# EAGLE board OpenPneu_ver2 (EAGLE 9.6.2), part 1 of 2
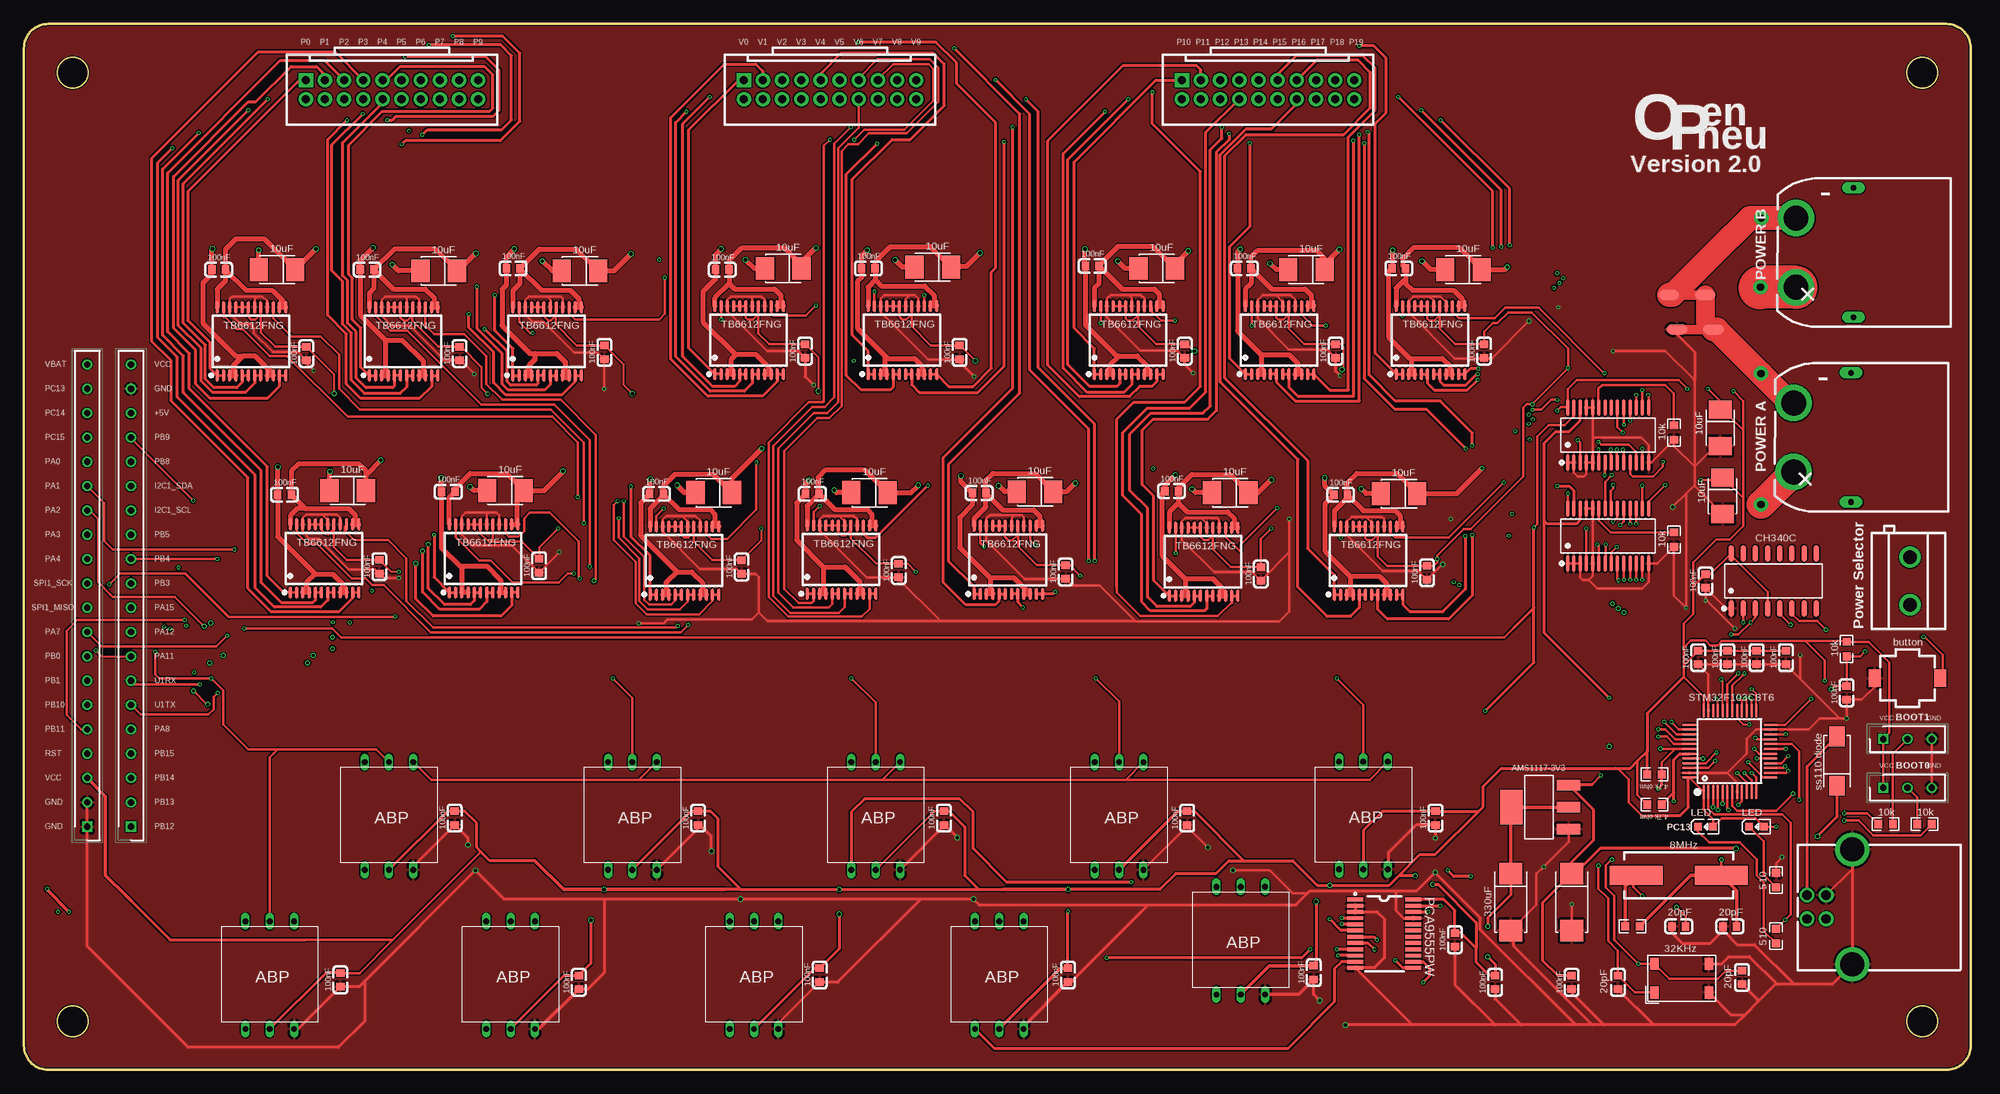
[diagram p3: board, top side]
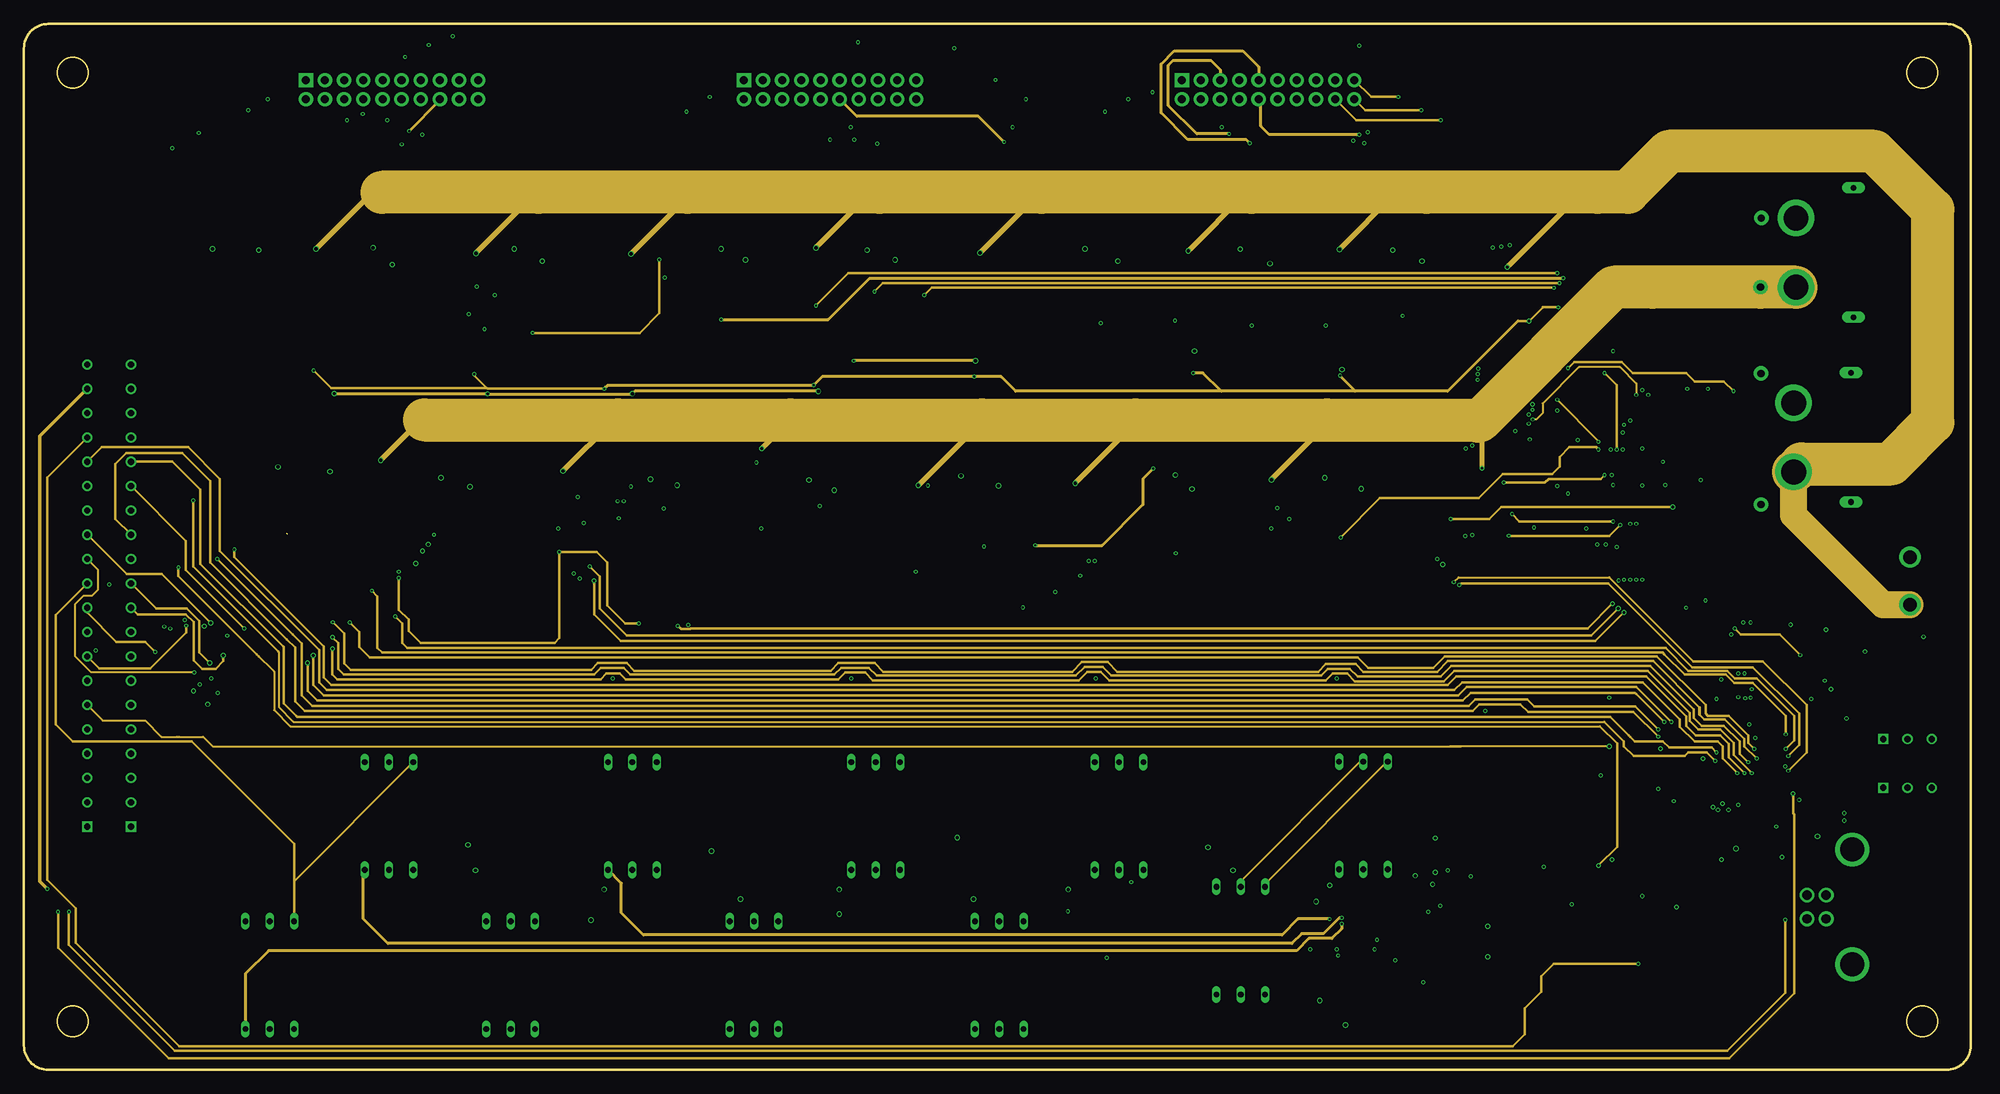
[diagram p4: board, inner layer Route2]
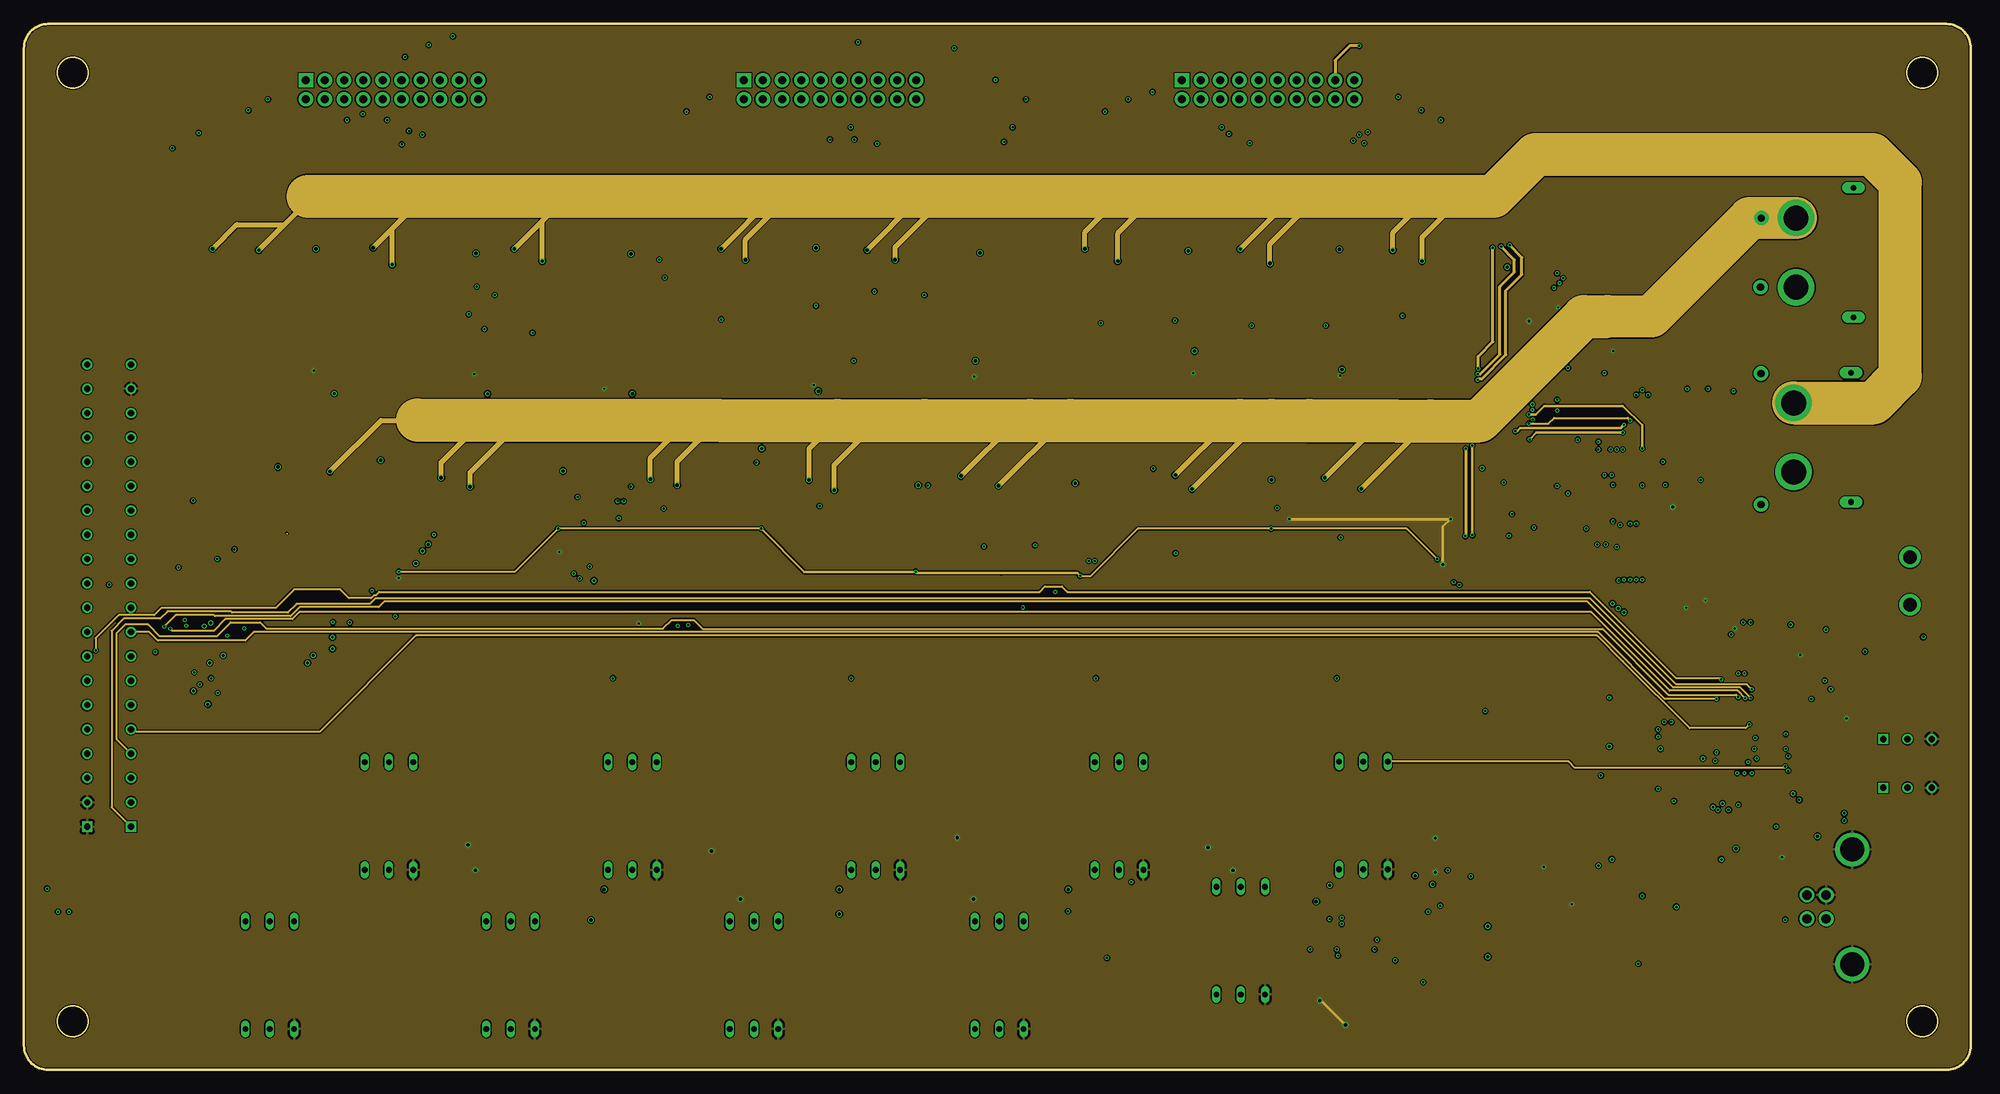
[diagram p5: board, inner layer Route15]
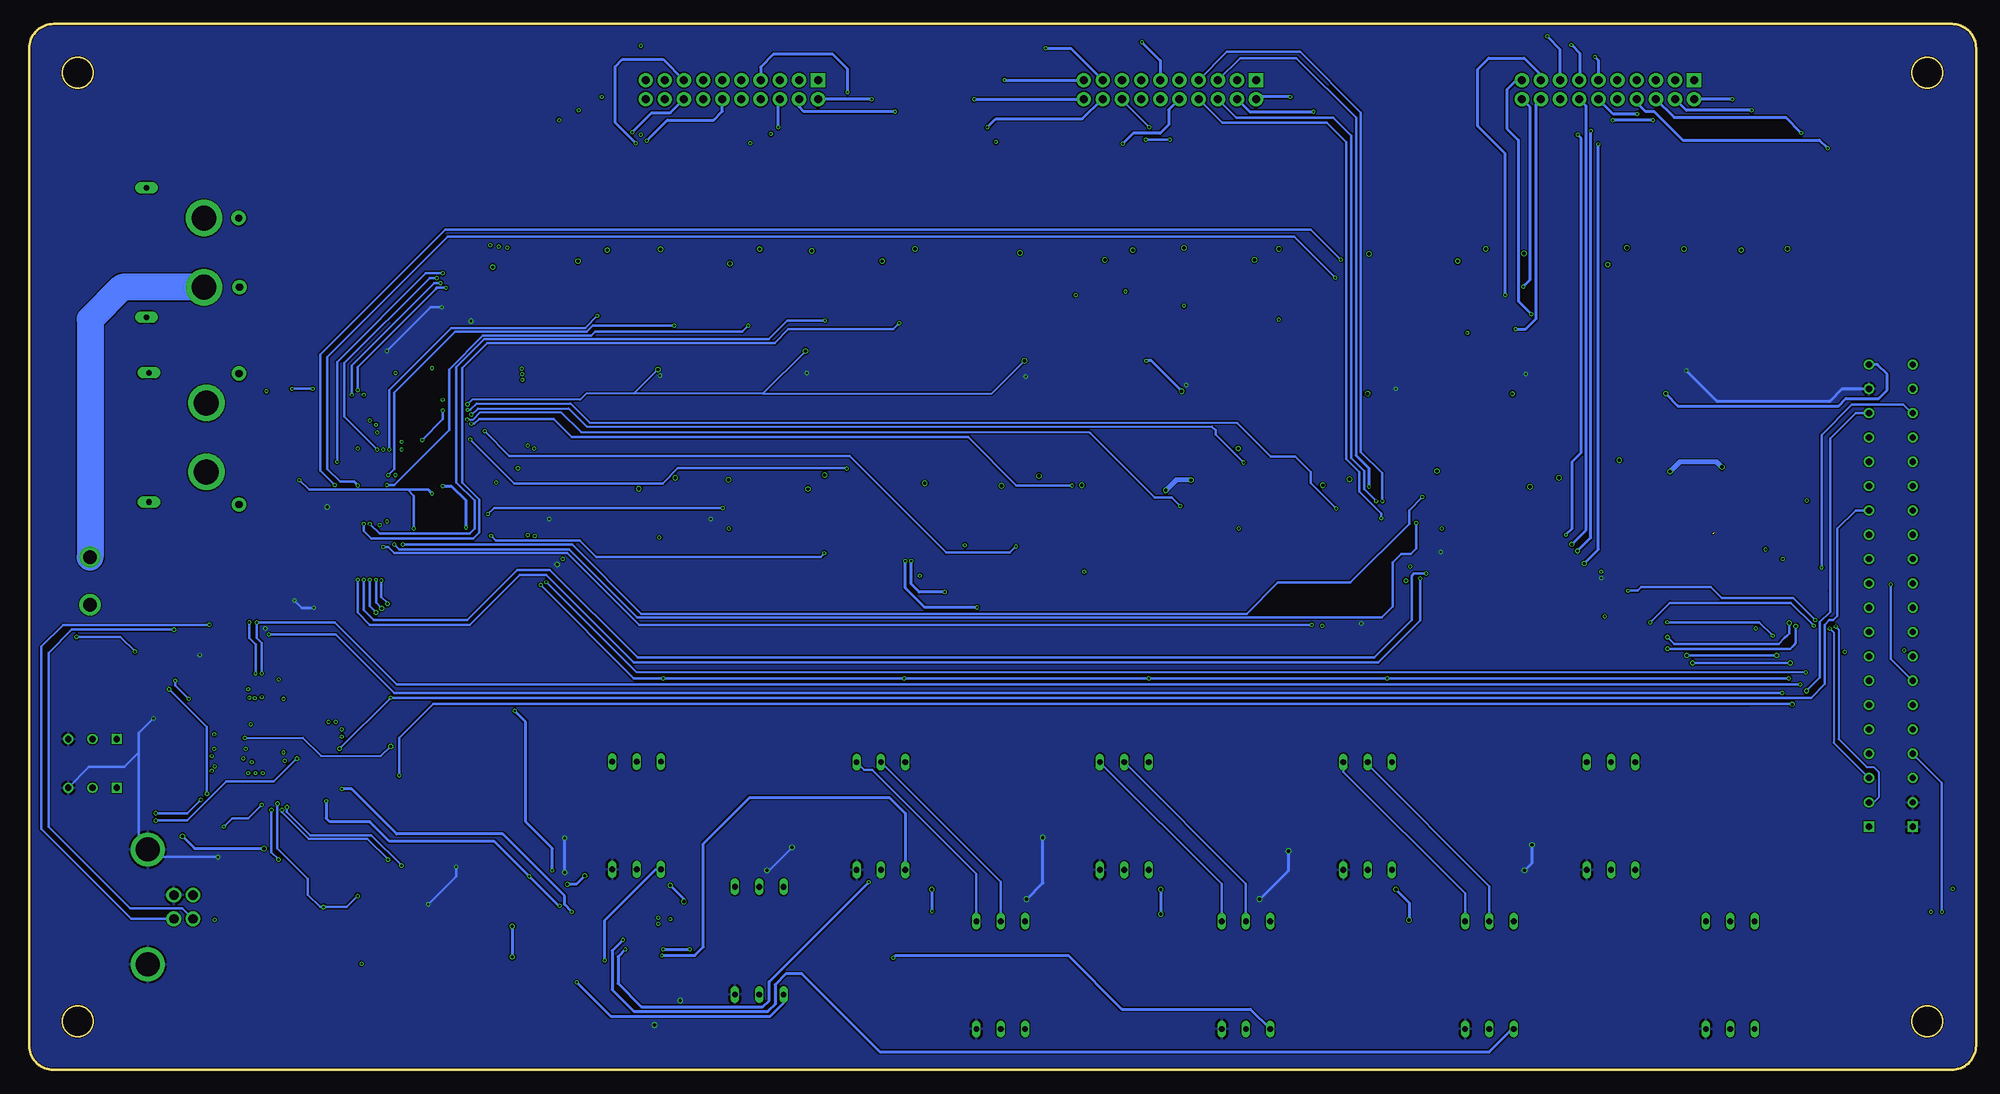
[diagram p6: board, bottom side, seen from below]

Size 203.2 x 109.22 mm. Coordinates in mm from the lower left corner, seen from the top.
Outline: 27.4,56.08 27.5,55.98
Outline: 0,106.68 0,2.54 arc90 2.54,0 200.66,0 arc90 203.2,2.54 203.2,106.68 arc90 200.66,109.22 2.54,109.22 arc90 0,106.68
Outline: circle at 198.12,104.14 radius 1.6
Outline: circle at 5.08,104.14 radius 1.6
Outline: circle at 5.08,5.08 radius 1.6
Outline: circle at 198.12,5.08 radius 1.6
Copper layers (1*2*15*16): Top 0.035559375mm / dielectric 0.17018125mm / Route2 0.01778125mm / dielectric 47mil / Route15 0.01778125mm / dielectric 0.17018125mm / Bottom 0.035559375mm
Design rules "jlcpcb-4-layer": minimum track width 5mil, minimum drill 0.2mm, track to track 0.126490625mm, track to pad 0.126490625mm, pad to pad 0.126490625mm, via to via 0.126490625mm, smd to smd 0mil, copper to edge 0.1mm, drill to drill 5mil, minimum pad ring 4mil, minimum via ring 4mil, stop-mask expansion 3mil, vias tented up to drill 100mil, thermal gap 10mil

## Footprints (pad centres in the part's own frame; a part is rotated, then mirrored left to right if it is on the bottom)
HDRV20W46P0X254_1X20_5090X254X = drill 0.65 pad 1.05 square: 1 0,0 | drill 0.65 pad 1.05: 2 2.54,0; 3 5.08,0; 4 7.62,0; 5 10.16,0; 6 12.7,0; 7 15.24,0; 8 17.78,0; 9 20.32,0; 10 22.86,0; 11 25.4,0; 12 27.94,0; 13 30.48,0; 14 33.02,0; 15 35.56,0; 16 38.1,0; 17 40.64,0; 18 43.18,0; 19 45.72,0; 20 48.26,0
LQFP-48_L7.0-W7.0-P0.50-LS9.27PRIMARY = smd 0.279 x 1.499: 1 -2.743,-4.242; 2 -2.261,-4.242; 3 -1.753,-4.242; 4 -1.245,-4.242; 5 -0.762,-4.242; 6 -0.254,-4.242; 7 0.254,-4.242; 8 0.762,-4.242; 9 1.245,-4.242; 10 1.753,-4.242; 11 2.261,-4.242; 12 2.743,-4.242; 25 2.743,4.242; 26 2.261,4.242; 27 1.753,4.242; 28 1.245,4.242; 29 0.762,4.242; 30 0.254,4.242; 31 -0.254,4.242; 32 -0.762,4.242; 33 -1.245,4.242; 34 -1.753,4.242; 35 -2.261,4.242; 36 -2.743,4.242 | smd 1.499 x 0.279: 13 4.242,-2.743; 14 4.242,-2.261; 15 4.242,-1.753; 16 4.242,-1.245; 17 4.242,-0.762; 18 4.242,-0.254; 19 4.242,0.254; 20 4.242,0.762; 21 4.242,1.245; 22 4.242,1.753; 23 4.242,2.261; 24 4.242,2.743; 37 -4.242,2.743; 38 -4.242,2.261; 39 -4.242,1.753; 40 -4.242,1.245; 41 -4.242,0.762; 42 -4.242,0.254; 43 -4.242,-0.254; 44 -4.242,-0.762; 45 -4.242,-1.245; 46 -4.242,-1.753; 47 -4.242,-2.261; 48 -4.242,-2.743
CRYSTAL-SMD_L11.5-W4.8-LS12.A9PRIMARY = smd 5.512 x 2.007: 1 -4.445,0; 2 4.445,0
C0603_1PRIMARY = smd 0.787 x 0.889: 1 -0.711,0; 2 0.711,0
R0603_1PRIMARY = smd 0.813 x 0.864: 1 -0.762,0; 2 0.762,0
MC-306_4P-L8.0-W3.2-P5.5-BL_1PRIMARY = smd 0.889 x 1.295: 1 -2.54,-1.575; 2 3.15,-1.575; 3 3.15,1.422; 4 -2.54,1.422
SOT-223-3_L6.5-W3.4-P2.30-LS59PRIMARY = smd 2.489 x 1.092: 1 2.972,-2.311; 2 2.972,0; 3 2.972,2.311 | smd 2.337 x 3.607: 4 -2.972,0
CAP-SMD_L6.0-W3.2-R-RD_1PRIMARY = smd 2.21 x 2.388: 1 2.972,0; 2 -2.972,0
USB-B-TH_USB-B01_1PRIMARY = drill 0.991 pad 1.524: 1 -1.245,-2.362; 2 1.245,-2.362; 3 1.245,-0.356; 4 -1.245,-0.356 | drill 2.489 pad 3.302: 5 -5.994,2.362; 6 5.994,2.362
SMA_L4.4-W2.8-LS5.4-RD_1PRIMARY = smd 2.057 x 1.626: 1 -2.565,0; 2 2.565,0
SOP-16_L10.0-W3.9-P1.27-LS6.C7PRIMARY = smd 0.559 x 1.753: 1 -4.445,-2.87; 2 -3.175,-2.87; 3 -1.905,-2.87; 4 -0.635,-2.87; 5 0.635,-2.87; 6 1.905,-2.87; 7 3.175,-2.87; 8 4.445,-2.87; 9 4.445,2.87; 10 3.175,2.87; 11 1.905,2.87; 12 0.635,2.87; 13 -0.635,2.87; 14 -1.905,2.87; 15 -3.175,2.87; 16 -4.445,2.87
HDRV20W46P0X254_1X20_5090X254X' = drill 0.65 pad 1.05 square: 1 0,0 | drill 0.65 pad 1.05: 2 2.54,0; 3 5.08,0
SW-SMD_SMK_JPM1040-XXXXFC_1PRIMARY = smd 1.245 x 1.803: 1 -3.429,0; 2 3.429,0
CONN-TH_P5.00_KF301-5.0-2P_1PRIMARY = drill 1.397 pad 2.21: 1 -2.489,0; 2 2.489,0
TSSOP-28_L9.7-W4.4-P0.65-LS6FFPRIMARY = smd 0.356 x 1.727: 1 -4.216,-2.87; 2 -3.581,-2.87; 3 -2.921,-2.87; 4 -2.286,-2.87; 5 -1.626,-2.87; 6 -0.965,-2.87; 7 -0.33,-2.87; 8 0.33,-2.87; 9 0.965,-2.87; 10 1.626,-2.87; 11 2.286,-2.87; 12 2.921,-2.87; 13 3.581,-2.87; 14 4.216,-2.87; 15 4.216,2.87; 16 3.581,2.87; 17 2.921,2.87; 18 2.286,2.87; 19 1.626,2.87; 20 0.965,2.87; 21 0.33,2.87; 22 -0.33,2.87; 23 -0.965,2.87; 24 -1.626,2.87; 25 -2.286,2.87; 26 -2.921,2.87; 27 -3.581,2.87; 28 -4.216,2.87
CAP-SMD_L3.5-W2.8-R-RD_1PRIMARY = smd 1.905 x 2.388: 1 1.905,0; 2 -1.905,0
SSOP-24_L8.3-W5.6-P0.65-LS7.93PRIMARY = smd 0.305 x 1.321: 1 -3.581,-3.556; 2 -2.921,-3.556; 3 -2.286,-3.556; 4 -1.626,-3.556; 5 -0.965,-3.556; 6 -0.33,-3.556; 7 0.33,-3.556; 8 0.965,-3.556; 9 1.626,-3.556; 10 2.286,-3.556; 11 2.921,-3.556; 12 3.581,-3.556; 13 3.581,3.556; 14 2.921,3.556; 15 2.286,3.556; 16 1.626,3.556; 17 0.965,3.556; 18 0.33,3.556; 19 -0.33,3.556; 20 -0.965,3.556; 21 -1.626,3.556; 22 -2.286,3.556; 23 -2.921,3.556; 24 -3.581,3.556
ABPDANN1.6BGSA = drill 0.6 long: GND 5.08,0; MISO 2.54,11.25; NC 0,11.25; SCLK 5.08,11.25; SS 0,0; VSUP 2.54,0
TSSOP-24_L7.8-W4.4-P0.65-LS652PRIMARY = smd 0.406 x 1.651: 1 -3.581,-3.023; 2 -2.921,-3.023; 3 -2.286,-3.023; 4 -1.626,-3.023; 5 -0.965,-3.023; 6 -0.33,-3.023; 7 0.33,-3.023; 8 0.965,-3.023; 9 1.626,-3.023; 10 2.286,-3.023; 11 2.921,-3.023; 12 3.581,-3.023; 13 3.581,3.023; 14 2.921,3.023; 15 2.286,3.023; 16 1.626,3.023; 17 0.965,3.023; 18 0.33,3.023; 19 -0.33,3.023; 20 -0.965,3.023; 21 -1.626,3.023; 22 -2.286,3.023; 23 -2.921,3.023; 24 -3.581,3.023
CONN-TH_XT60PW-M_1PRIMARY = drill 2.591 pad 3.81: 1 2.997,-3.607; 2 2.997,3.607 | drill 0.61 pad 1.194 long: 3 -2.997,6.756; 4 -2.997,-6.756
ZERO_OHM_FOOT = smd 2.184 x 1.067: 1 -1.27,2.54; 2 2.54,2.54
CONN-TH_PHB-2-10A_1PRIMARY = drill 0.838 pad 1.499 square: 1 8.992,-0.991 | drill 0.838 pad 1.499: 2 8.992,0.991; 3 7.01,-0.991; 4 7.01,0.991; 5 5.004,-0.991; 6 5.004,0.991; 7 2.997,-0.991; 8 2.997,0.991; 9 0.991,-0.991; 10 0.991,0.991; 11 -0.991,-0.991; 12 -0.991,0.991; 13 -2.997,-0.991; 14 -2.997,0.991; 15 -5.004,-0.991; 16 -5.004,0.991; 17 -7.01,-0.991; 18 -7.01,0.991; 19 -8.992,-0.991; 20 -8.992,0.991
LED0603-RD_1PRIMARY = smd 0.787 x 0.787: 1 -0.787,0; 2 0.787,0
4K7 = smd 0.813 x 0.864: 1 -0.762,0; 2 0.762,0

## Placement (x,y rotation side)
J1  D01-9922046  [HDRV20W46P0X254_1X20_5090X254X]  11.18,25.4 90 top
J2  D01-9922046  [HDRV20W46P0X254_1X20_5090X254X]  6.6,25.4 90 top
U$1  STM32F103_DEVICE  [LQFP-48_L7.0-W7.0-P0.50-LS9.27PRIMARY]  178.05,33.27 0 top
U$2  8MHZ_DEVICE  [CRYSTAL-SMD_L11.5-W4.8-LS12.A9PRIMARY]  172.72,20.32 0 top
U$3  20PF_DEVICE  [C0603_1PRIMARY]  172.72,14.99 0 top
U$4  20PF_DEVICE  [C0603_1PRIMARY]  178.05,14.99 0 top
U$5  1M_DEVICE  [R0603_1PRIMARY]  167.89,14.99 0 top
U$6  32KHZ_DEVICE  [MC-306_4P-L8.0-W3.2-P5.5-BL_1PRIMARY]  172.72,9.65 0 top
U$7  20PF_DEVICE  [C0603_1PRIMARY]  179.32,9.65 90 top
U$8  20PF_DEVICE  [C0603_1PRIMARY]  166.37,9.14 90 top
U$9  VOLTAGE_REGULATOR  [SOT-223-3_L6.5-W3.4-P2.30-LS59PRIMARY]  158.24,27.43 0 top
U$10  100UF  [CAP-SMD_L6.0-W3.2-R-RD_1PRIMARY]  161.54,17.53 90 top
U$11  100NF_DEVICE  [C0603_1PRIMARY]  161.54,9.14 90 top
U$12  330UF_DEVICE  [CAP-SMD_L6.0-W3.2-R-RD_1PRIMARY]  155.19,17.53 90 top
U$13  100NF_DEVICE  [C0603_1PRIMARY]  153.54,9.14 90 top
U$14  100NF_DEVICE  [C0603_1PRIMARY]  177.8,43.05 90 top
U$15  100NF_DEVICE  [C0603_1PRIMARY]  180.85,43.05 90 top
U$16  100NF_DEVICE  [C0603_1PRIMARY]  174.75,43.05 90 top
U$17  100NF_DEVICE  [C0603_1PRIMARY]  175.51,51.05 90 top
U$18  USB_NORM_VER2_DEV  [USB-B-TH_USB-B01_1PRIMARY]  188.47,17.02 270 top
U$19  DIODE_DEVICE  [SMA_L4.4-W2.8-LS5.4-RD_1PRIMARY]  189.23,32.26 90 top
U$20  CH340C_DEVICE  [SOP-16_L10.0-W3.9-P1.27-LS6.C7PRIMARY]  182.63,51.05 0 top
U$21  100NF_DEVICE  [C0603_1PRIMARY]  183.9,43.05 90 top
U$22  3PIN_DEVICE  [HDRV20W46P0X254_1X20_5090X254X']  194.06,29.46 0 top
U$23  3PIN_DEVICE  [HDRV20W46P0X254_1X20_5090X254X']  194.06,34.54 0 top
U$24  10K_DEVICE  [R0603_1PRIMARY]  198.37,25.65 0 top
U$25  10K_DEVICE  [R0603_1PRIMARY]  194.31,25.65 0 top
U$26  BUTTON_DEVICE  [SW-SMD_SMK_JPM1040-XXXXFC_1PRIMARY]  196.6,40.89 0 top
U$27  POWER  [CONN-TH_P5.00_KF301-5.0-2P_1PRIMARY]  196.85,51.05 90 top
U$28  10K_DEVICE  [R0603_1PRIMARY]  190.25,43.94 90 top
U$29  PCA9685PCA9685  [TSSOP-28_L9.7-W4.4-P0.65-LS6FFPRIMARY]  165.35,55.75 0 top
U$30  PCA9685PCA9685  [TSSOP-28_L9.7-W4.4-P0.65-LS6FFPRIMARY]  165.35,66.29 0 top
U$31  10K_DEVICE  [R0603_1PRIMARY]  172.21,55.37 90 top
U$32  10UF_DEVICE  [CAP-SMD_L3.5-W2.8-R-RD_1PRIMARY]  177.29,59.94 90 top
U$33  10UF_DEVICE  [CAP-SMD_L3.5-W2.8-R-RD_1PRIMARY]  177.04,67.06 90 top
U$34  10K_DEVICE  [R0603_1PRIMARY]  172.21,66.55 90 top
U$35  TB6612FNG  [SSOP-24_L8.3-W5.6-P0.65-LS7.93PRIMARY]  23.75,76.07 0 top
U$36  TB6612FNG  [SSOP-24_L8.3-W5.6-P0.65-LS7.93PRIMARY]  31.38,53.41 0 top
U$37  100NF_DEVICE  [C0603_1PRIMARY]  20.32,83.57 0 top
U$38  10UF_DEVICE  [CAP-SMD_L3.5-W2.8-R-RD_1PRIMARY]  26.42,83.57 0 top
U$39  100NF_DEVICE  [C0603_1PRIMARY]  29.46,74.8 90 top
U$40  100NF_DEVICE  [C0603_1PRIMARY]  27.2,60.07 0 top
U$41  10UF_DEVICE  [CAP-SMD_L3.5-W2.8-R-RD_1PRIMARY]  33.8,60.5 0 top
U$42  100NF_DEVICE  [C0603_1PRIMARY]  37.09,52.54 90 top
U$43  TB6612FNG  [SSOP-24_L8.3-W5.6-P0.65-LS7.93PRIMARY]  39.62,76.07 0 top
U$44  100NF_DEVICE  [C0603_1PRIMARY]  35.81,83.57 0 top
U$45  10UF_DEVICE  [CAP-SMD_L3.5-W2.8-R-RD_1PRIMARY]  43.31,83.44 0 top
U$46  100NF_DEVICE  [C0603_1PRIMARY]  45.47,74.8 90 top
U$47  TB6612FNG  [SSOP-24_L8.3-W5.6-P0.65-LS7.93PRIMARY]  47.98,53.41 0 top
U$48  100NF_DEVICE  [C0603_1PRIMARY]  44.28,60.37 0 top
U$49  10UF_DEVICE  [CAP-SMD_L3.5-W2.8-R-RD_1PRIMARY]  50.25,60.5 0 top
U$50  100NF_DEVICE  [C0603_1PRIMARY]  53.77,52.64 90 top
U$51  TB6612FNG  [SSOP-24_L8.3-W5.6-P0.65-LS7.93PRIMARY]  54.61,76.07 0 top
U$52  100NF_DEVICE  [C0603_1PRIMARY]  51.05,83.69 0 top
U$53  10UF_DEVICE  [CAP-SMD_L3.5-W2.8-R-RD_1PRIMARY]  58.04,83.44 0 top
U$54  100NF_DEVICE  [C0603_1PRIMARY]  60.58,74.93 90 top
U$55  TB6612FNG  [SSOP-24_L8.3-W5.6-P0.65-LS7.93PRIMARY]  115.32,76.2 0 top
U$56  100NF_DEVICE  [C0603_1PRIMARY]  111.51,83.95 0 top
U$57  10UF_DEVICE  [CAP-SMD_L3.5-W2.8-R-RD_1PRIMARY]  118.24,83.69 0 top
U$58  100NF_DEVICE  [C0603_1PRIMARY]  121.16,75.06 90 top
U$59  TB6612FNG  [SSOP-24_L8.3-W5.6-P0.65-LS7.93PRIMARY]  123.13,53.06 0 top
U$60  100NF_DEVICE  [C0603_1PRIMARY]  119.78,60.44 0 top
U$61  10UF_DEVICE  [CAP-SMD_L3.5-W2.8-R-RD_1PRIMARY]  125.9,60.27 0 top
U$62  100NF_DEVICE  [C0603_1PRIMARY]  129.1,51.79 90 top
U$63  TB6612FNG  [SSOP-24_L8.3-W5.6-P0.65-LS7.93PRIMARY]  131.06,76.2 0 top
U$64  100NF_DEVICE  [C0603_1PRIMARY]  127.38,83.69 0 top
U$65  10UF_DEVICE  [CAP-SMD_L3.5-W2.8-R-RD_1PRIMARY]  133.86,83.57 0 top
U$66  100NF_DEVICE  [C0603_1PRIMARY]  136.91,75.06 90 top
U$67  TB6612FNG  [SSOP-24_L8.3-W5.6-P0.65-LS7.93PRIMARY]  140.35,53.18 0 top
U$68  100NF_DEVICE  [C0603_1PRIMARY]  137.43,60.04 0 top
U$69  10UF_DEVICE  [CAP-SMD_L3.5-W2.8-R-RD_1PRIMARY]  143.52,60.17 0 top
U$70  100NF_DEVICE  [C0603_1PRIMARY]  146.44,51.91 90 top
U$71  TB6612FNG  [SSOP-24_L8.3-W5.6-P0.65-LS7.93PRIMARY]  146.81,76.2 0 top
U$72  100NF_DEVICE  [C0603_1PRIMARY]  143.51,83.69 0 top
U$73  10UF_DEVICE  [CAP-SMD_L3.5-W2.8-R-RD_1PRIMARY]  150.24,83.57 0 top
U$74  100NF_DEVICE  [C0603_1PRIMARY]  152.4,75.06 90 top
U$75  TB6612FNG  [SSOP-24_L8.3-W5.6-P0.65-LS7.93PRIMARY]  75.69,76.2 0 top
U$76  100NF_DEVICE  [C0603_1PRIMARY]  72.9,83.57 0 top
U$77  10UF_DEVICE  [CAP-SMD_L3.5-W2.8-R-RD_1PRIMARY]  79.25,83.69 0 top
U$78  100NF_DEVICE  [C0603_1PRIMARY]  81.53,75.06 90 top
U$79  TB6612FNG  [SSOP-24_L8.3-W5.6-P0.65-LS7.93PRIMARY]  68.94,53.18 0 top
U$80  100NF_DEVICE  [C0603_1PRIMARY]  66.02,60.14 0 top
U$81  10UF_DEVICE  [CAP-SMD_L3.5-W2.8-R-RD_1PRIMARY]  71.99,60.27 0 top
U$82  100NF_DEVICE  [C0603_1PRIMARY]  74.91,52.52 90 top
U$83  TB6612FNG  [SSOP-24_L8.3-W5.6-P0.65-LS7.93PRIMARY]  91.69,76.2 0 top
U$84  100NF_DEVICE  [C0603_1PRIMARY]  88.14,83.69 0 top
U$85  10UF_DEVICE  [CAP-SMD_L3.5-W2.8-R-RD_1PRIMARY]  94.87,83.82 0 top
U$86  100NF_DEVICE  [C0603_1PRIMARY]  97.66,74.93 90 top
U$87  TB6612FNG  [SSOP-24_L8.3-W5.6-P0.65-LS7.93PRIMARY]  85.34,53.28 0 top
U$88  100NF_DEVICE  [C0603_1PRIMARY]  82.29,60.14 0 top
U$89  10UF_DEVICE  [CAP-SMD_L3.5-W2.8-R-RD_1PRIMARY]  88.26,60.27 0 top
U$90  100NF_DEVICE  [C0603_1PRIMARY]  91.31,52.14 90 top
U$91  TB6612FNG  [SSOP-24_L8.3-W5.6-P0.65-LS7.93PRIMARY]  102.75,53.26 0 top
U$92  100NF_DEVICE  [C0603_1PRIMARY]  99.7,60.24 0 top
U$93  10UF_DEVICE  [CAP-SMD_L3.5-W2.8-R-RD_1PRIMARY]  105.54,60.37 0 top
U$94  100NF_DEVICE  [C0603_1PRIMARY]  108.72,51.99 90 top
U$95  ABPDANN1.6BGSA  [ABPDANN1.6BGSA]  35.56,20.89 0 top
U$96  ABPDANN1.6BGSA  [ABPDANN1.6BGSA]  23.11,4.27 0 top
U$97  100NF_DEVICE  [C0603_1PRIMARY]  44.96,26.29 90 top
U$98  100NF_DEVICE  [C0603_1PRIMARY]  33.02,9.4 90 top
U$99  ABPDANN1.6BGSA  [ABPDANN1.6BGSA]  60.96,20.89 0 top
U$100  100NF_DEVICE  [C0603_1PRIMARY]  70.36,26.29 90 top
U$101  ABPDANN1.6BGSA  [ABPDANN1.6BGSA]  48.26,4.27 0 top
U$102  100NF_DEVICE  [C0603_1PRIMARY]  57.91,9.14 90 top
U$103  ABPDANN1.6BGSA  [ABPDANN1.6BGSA]  86.36,20.89 0 top
U$104  100NF_DEVICE  [C0603_1PRIMARY]  96.01,26.29 90 top
U$105  ABPDANN1.6BGSA  [ABPDANN1.6BGSA]  73.66,4.27 0 top
U$106  100NF_DEVICE  [C0603_1PRIMARY]  83.06,9.91 90 top
U$107  ABPDANN1.6BGSA  [ABPDANN1.6BGSA]  111.76,20.89 0 top
U$108  100NF_DEVICE  [C0603_1PRIMARY]  121.41,26.29 90 top
U$109  ABPDANN1.6BGSA  [ABPDANN1.6BGSA]  99.26,4.27 0 top
U$110  100NF_DEVICE  [C0603_1PRIMARY]  108.97,9.91 90 top
U$111  ABPDANN1.6BGSA  [ABPDANN1.6BGSA]  137.26,20.94 0 top
U$112  100NF_DEVICE  [C0603_1PRIMARY]  147.32,26.29 90 top
U$113  ABPDANN1.6BGSA  [ABPDANN1.6BGSA]  124.46,7.87 0 top
U$114  100NF_DEVICE  [C0603_1PRIMARY]  134.62,10.16 90 top
U$115  TSSOP-24_L7.8-W4.4-P0.65-LS652  [TSSOP-24_L7.8-W4.4-P0.65-LS652PRIMARY]  141.99,14.22 270 top
U$116  100NF_DEVICE  [C0603_1PRIMARY]  149.35,13.59 90 top
U$117  XT60_DEVICE  [CONN-TH_XT60PW-M_1PRIMARY]  187.71,66.04 180 top
U$118  XT60_DEVICE  [CONN-TH_XT60PW-M_1PRIMARY]  187.96,85.34 180 top
U$119  ZERO_OHM  [ZERO_OHM_FOOT]  172.95,78.38 0 top
U$120  ZERO_OHM  [ZERO_OHM_FOOT]  173.8,74.77 0 top
U$121  PHB-2-10  [CONN-TH_PHB-2-10A_1PRIMARY]  38.42,102.36 180 top
U$122  PHB-2-10  [CONN-TH_PHB-2-10A_1PRIMARY]  129.86,102.36 180 top
U$123  PHB-2-10  [CONN-TH_PHB-2-10A_1PRIMARY]  84.14,102.36 180 top
U$124  LED  [LED0603-RD_1PRIMARY]  180.85,25.4 0 top
U$125  LED  [LED0603-RD_1PRIMARY]  175.51,25.4 0 top
U$126  510_OHM_DEVICE  [R0603_1PRIMARY]  182.88,19.81 90 top
U$127  510_OHM_DEVICE  [R0603_1PRIMARY]  182.88,13.97 90 top
U$128  4K7  [4K7]  170.18,27.69 180 top
U$129  4K7  [4K7]  170.18,30.86 180 top
U$130  100NF_DEVICE  [C0603_1PRIMARY]  190.25,39.37 90 top

## Tracks (layer width: path | path; a pad name or v marks a point on that pad's centre or on a via)
5V_HIGH_CURRENT1  (via drill 0.35, 0.75 pad 1.5)
  Top 0.5: v30.48,85.72 U$38.1 25.15,86.74 22.1,86.74 21.03,85.67 U$37.2 | U$37.2 21.03,82.37 20.17,81.51 U$35.24 | U$35.14 27.05,79.63 | 27.05,79.63 U$35.13 | U$37.2 23.19,81.41 25.91,81.41 27.05,80.26 27.05,79.63 | v47.18,85.27 45.35,83.44 U$45.1 42.93,85.72 38.68,85.72 U$44.2 | U$44.2 36.52,81.61 36.04,81.13 U$43.24 | U$44.2 38.56,81.53 41.91,81.53 42.8,80.64 42.8,79.63 | U$43.14 42.8,79.63 | 42.8,79.63 U$43.13 | U$52.2 53.8,85.72 57.66,85.72 U$53.1 61.59,83.44 v63.37,85.22 | U$52.2 51.77,82.12 51.03,81.38 U$51.24 | U$52.2 54.05,81.41 57.02,81.41 57.91,80.52 57.91,79.63 | U$75.14 78.87,79.76 | 78.87,79.76 U$75.13 | U$75.24 72.11,80.62 73.61,82.12 | 73.61,82.12 U$76.2 73.61,84.53 74.93,85.85 79.38,85.85 81.15,84.07 U$77.1 81.15,84.33 v82.66,85.84 | 73.61,82.12 74.19,81.53 78.36,81.53 78.99,80.9 78.99,79.88 78.87,79.76 | v99.79,85.32 98.42,83.95 96.9,83.95 U$85.1 94.61,85.98 90.42,85.98 88.85,84.4 U$84.2 88.85,82.5 | U$83.24 88.11,81.76 88.85,82.5 | 88.85,82.5 89.48,81.86 94.03,81.86 95,80.9 95,79.88 94.87,79.76 | U$83.13 94.87,79.76 | 94.87,79.76 U$83.14 | v121.52,85.51 120.14,84.13 U$57.1 117.86,85.98 114.17,85.98 112.22,84.02 U$56.2 | U$56.2 112.22,82.12 111.73,81.64 U$55.24 | U$56.2 114.63,81.53 117.98,81.53 118.49,81.03 118.49,80.01 U$55.14 U$55.13 | U$64.2 128.09,84.91 128.78,85.6 134.87,85.6 135.76,84.71 U$65.1 135.76,84.14 v137.3,85.68 | U$64.2 128.09,82.12 127.48,81.51 U$63.24 | U$64.2 130.25,81.53 133.73,81.53 134.37,80.9 134.37,79.88 134.24,79.76 | U$63.14 134.24,79.76 | 134.24,79.76 U$63.13 | v154.81,83.82 154.56,83.57 U$73.1 149.86,85.85 145.03,85.85 143.89,84.71 143.89,84.02 U$72.2 144.22,82.12
  Top 0.5: U$71.24 143.23,81.64 143.97,82.37 144.22,82.12 | 144.22,82.12 144.93,81.41 149.22,81.41 150.11,80.52 150.11,79.76 | U$71.14 150.11,79.76 | 150.11,79.76 U$71.13
  Top 0.55: U$51.13 57.91,79.63 U$51.14
  Top 3: U$117.2 v181.31,59.03 v181.3,59.03
  Route2 0.5: v30.48,85.72 36.38,91.63 37.35,91.63 | v47.18,85.27 53.54,91.63 53.7,91.63 | v63.37,85.22 69.25,91.09 69.25,91.63 | v82.66,85.84 88.46,91.63 89.3,91.63 | v99.79,85.32 106.11,91.63 106.2,91.63 | v121.52,85.51 127.64,91.63 128.15,91.63 | v137.3,85.68 143.25,91.63 146.4,91.63 | v154.81,83.82 162.62,91.63 164.25,91.63
  Route2 2.8: U$27.1 194.06,48.56 184.71,57.91 U$117.2
  Route2 4.5: U$117.2 185.56,63.28 194.9,63.28 199.25,67.63 199.25,89.83 193.15,95.93 171.7,95.93 167.4,91.63 164.25,91.63 146.4,91.63 128.15,91.63 106.2,91.63 89.3,91.63 69.25,91.63 53.7,91.63 37.35,91.63
5V_HIGH_CURRENT2  (via drill 0.25, 0.35, 0.75 pad 1.5)
  Top 0.5: v37.25,63.66 35.71,62.12 U$41.1 35.71,62.51 34.94,63.27 28.66,63.27 27.91,62.53 U$40.2 29.36,58.62 | 29.36,58.62 33.92,58.62 34.6,57.94 34.6,56.97 | 52.4,60.5 U$49.1 50.38,62.27 46.57,62.27 45,60.7 U$48.2 44.4,59.77 U$47.24 | 52.4,60.5 54.32,60.5 56.26,62.44 v56.26,62.54 | U$79.13 72.12,56.74 | 72.12,56.74 U$79.14 | v77.01,64.89 73.89,61.77 U$81.1 71.99,62.17 67.93,62.17 66.73,60.98 U$80.2 | U$80.2 66.73,59.96 65.36,58.59 U$79.24 | U$80.2 68.38,58.49 71.61,58.49 72.12,57.98 72.12,56.74 | U$88.2 81.75,58.9 U$87.24 | U$88.2 82.89,60.26 82.89,61.86 83.7,62.68 87.75,62.68 U$89.1 | U$89.1 90.16,60.41 | U$89.1 92.58,60.27 v93.34,61.03 | U$88.2 84.65,58.49 88,58.49 88.51,57.98 88.51,56.84 | U$87.14 88.51,56.84 | 88.51,56.84 U$87.13 | U$92.2 100.41,61.59 101.09,62.27 105.54,62.27 U$93.1 108.84,60.37 v109.73,61.26 | U$91.13 105.92,56.81 | 105.92,56.81 U$91.14 | U$91.24 99.17,57.55 100.41,58.8 U$92.2 | U$92.2 102.19,58.46 105.41,58.46 106.05,57.83 106.05,56.94 105.92,56.81 | U$59.24 119.55,58.24 120.49,59.18 | U$59.14 126.3,56.61 | 126.3,56.61 U$59.13 | 126.3,56.61 126.3,57.63 125.67,58.27 121.41,58.27 120.49,59.18 | v130.2,61.62 128.85,60.27 U$61.1 125.9,62.18 121.9,62.18 120.49,60.77 U$60.2 120.49,59.18 | U$68.2 138.14,59.74 136.76,58.37 U$67.24 | U$68.2 139.79,58.39 143.14,58.39 143.65,57.88 143.65,56.87 143.52,56.74 | U$67.14 143.52,56.74 | 143.52,56.74 U$67.13 | U$47.14 U$47.13 51.5,57.03 51.5,59.6 52.4,60.5 | 29.36,58.62 28.54,58.62 27.8,57.88 U$36.24 | U$68.2 138.14,61.32 139.1,62.28 143.32,62.28 U$69.1 149.54,60.17 v152.2,62.83
  Top 0.55: U$36.13 34.6,56.97 U$36.14
  Top 4.5: U$118.2 v181.26,81.74 181.2,81.68
  Route2 0.5: v152.2,62.83 152.2,68.93 165.7,82.43 169.31,82.43 170,81.74 | 41.8,67.88 43.15,67.88 43.9,68.63 42.22,68.63 v37.25,63.66 | v56.26,62.54 61.6,67.88 62,67.88 | v77.01,64.89 80,67.87 80,67.88 | v93.34,61.03 100,67.7 100,67.88 | v109.73,61.26 116,67.53 116,67.88 | v130.2,61.62 136,67.42 136,67.88
  Route2 4.5: U$118.2 v181.26,81.74 170,81.74 165.9,81.74 151.93,67.76 | 151.5,67.76 151.93,67.76 | 151.93,67.76 151.81,67.88 136,67.88 116,67.88 100,67.88 80,67.88 62,67.88 41.8,67.88
  Bottom 2.8: U$118.2 193.47,81.74 196.85,78.36 U$27.2
+5V  (via drill 0.2, 0.3, 0.35)
  Top 0.25: v17.7,39.58 19.1,38.18 v19.2,38.18
  Top 0.254: 163.68,29.82 v164.59,30.73
  Top 0.3: U$19.1 189.23,26.42 v187.2,24.38 | v178.69,23.11 164.54,23.11 161.93,20.5 | U$10.1 161.93,20.5 | 161.93,20.5 162.48,20.5 | U$10.1 158.5,17.45 158.5,11.43 160.07,9.86 U$11.2 | U$10.1 161.54,21.72 163.83,24 163.83,27.13 U$9.3 161.29,29.82 163.68,29.82
  Bottom 0.25: 15.24,50.04 15.24,47.84 16.3,46.78 16.3,40.98 v17.7,39.58 | v19.2,38.18 19.25,38.23 24.2,38.23
  Bottom 0.254: v164.59,30.73 164.59,34.67 161.04,38.23 24.2,38.23 23.62,38.23 | 15.24,50.04 15.24,65.91 12.57,68.58 J1.18
  Bottom 0.3: v187.2,24.38 185.93,23.11 v178.69,23.11
BOOT0  (via drill 0.25)
  Top 0.254: U$24.2 197.99,24.51 193.04,24.51 191.52,26.03 v189.99,26.03 | v175.26,32.51 U$1.44
  Bottom 0.254: v189.99,26.03 186.69,26.03 182.63,30.1 177.67,30.1 v175.26,32.51
BOOT0_MIDDLE
  Top 0.25: U$22.2 197.61,28.45 U$24.1
BOOT1  (via drill 0.25)
  Top 0.254: U$25.1 193.42,25.78 192.41,26.8 v189.99,26.8 | v185.29,28.19 185.29,33.27 184.53,34.04 U$1.20
  Bottom 0.254: v189.99,26.8 186.69,26.8 v185.29,28.19
BOOT1_MIDDLE
  Top 0.25: U$25.2 195.07,33.02 195.33,33.27 U$23.2
D+  (via drill 0.25)
  Top 0.25: v184.4,46.48 183.26,47.62 U$20.5
  Bottom 0.25: U$18.3 192.56,15.77 201.93,25.15 201.93,44.2 199.64,46.48 v184.4,46.48
D-  (via drill 0.25)
  Top 0.25: v188.09,45.97 187.2,46.86 185.29,46.86 184.53,47.62 U$20.6
  Bottom 0.25: U$18.2 187.22,16.89 192.66,16.89 201.17,25.4 201.17,43.56 198.75,45.97 v188.09,45.97
GND  (via drill 0.2, 0.25, 0.3, 0.35)
  Top 0.25: U$126.2 182.88,21.59 v183.51,22.23 | U$18.4 190.81,20.95 190.83,20.95 | 185.42,40.82 189.53,36.7 189.74,36.7 v190.25,36.7 U$130.1 191.82,38.66 193.17,40 U$26.1 | 185.42,40.82 U$21.1 U$15.1 U$14.1 U$16.1 | U$22.3 U$23.3 | 85.08,57.86 83.43,57.86 83.05,57.48 U$87.22 83.05,56.33 87.95,51.43 91.1,51.43 | 85.08,57.86 85.67,57.27 U$87.18 | 85.08,57.86 86.61,57.86 86.96,57.5 U$87.16 | 91.1,51.43 U$90.1 | U$91.16 104.37,57.73 104.14,57.96 103.38,57.96 | 103.38,57.96 103.08,57.65 U$91.18 | 103.38,57.96 100.84,57.96 100.46,57.58 U$91.22 100.46,55.29 104.47,51.28 U$94.1 109.41,50.58 112.28,50.58 116.01,46.85 | 68.69,57.86 67.04,57.86 66.66,57.48 U$79.22 66.66,56.21 70.54,52.32 74.39,52.32 U$82.1 76.39,51.8 76.7,51.49 76.7,47.75 | 68.69,57.86 70.08,57.86 70.57,57.37 U$79.16 | U$79.18 69.27,57.27 68.69,57.86 | U$36.22 29.09,57.6 29.48,57.98 31.13,57.98 | 31.13,57.98 32.65,57.98 33.01,57.63 U$36.16 | U$36.18 31.71,57.4 31.13,57.98 | U$36.22 29.09,56.33 | 36.84,52.09 U$42.1 | 24.38,80.77 21.72,80.77 21.46,80.52 U$35.22 21.46,78.99 22.61,77.85 23.62,77.85 24,77.47 24,76.96 26.04,74.93 28.63,74.93 U$39.1 29.46,73.79 v30.23,73.02 | 24.38,80.77 24.89,80.77 25.38,80.29 U$35.16 | U$35.18 24.08,80.47 24.38,80.77 | U$43.16 41.25,80.42 40.89,80.77 40.13,80.77 | 40.13,80.77 39.95,80.59 U$43.18 | 40.13,80.77 37.72,80.77 37.34,80.39 U$43.22 37.34,78.74 38.35,77.72 40.26,77.72 43.85,74.13 45.43,74.13 U$46.1 45.59,74.09 46.99,72.69 v46.99,72.64 | 54.61,80.77 52.7,80.77 52.32,80.39 U$51.22 52.32,78.87 53.09,78.11 54.23,78.11 57.44,74.89 59.91,74.89 U$54.1 v60.58,71.12 60.58,70.99 | 54.61,80.77 54.99,80.39 54.99,79.68 U$51.18
  Top 0.25: U$51.16 56.24,80.54 56.01,80.77 54.61,80.77 | 75.82,80.77 73.79,80.77 73.41,80.39 U$75.22 73.41,79.25 77.6,75.06 80.82,75.06 | 75.82,80.77 76.02,80.57 U$75.18 | 75.82,80.77 76.96,80.77 77.32,80.42 U$75.16 | 81.48,74.3 81.51,74.32 U$78.1 | U$83.16 93.32,80.54 92.96,80.9 92.46,80.9 | 92.46,80.9 92.02,80.47 U$83.18 | 92.46,80.9 89.79,80.9 89.41,80.52 U$83.22 89.41,79.12 94.36,74.17 97.61,74.17 U$86.1 | 115.32,80.9 113.41,80.9 113.03,80.52 U$55.22 113.03,78.61 116.53,75.11 120.4,75.11 U$58.1 | 115.32,80.9 115.65,80.57 U$55.18 | 115.32,80.9 116.59,80.9 116.97,80.52 116.97,79.78 U$55.16 | 130.68,80.9 129.29,80.9 128.78,80.39 U$63.22 128.78,78.49 132.03,75.23 136.02,75.23 U$66.1 | 130.68,80.9 132.21,80.9 132.69,80.42 U$63.16 | U$63.18 131.39,80.19 130.68,80.9 | U$71.16 148.44,80.17 147.84,80.77 146.69,80.77 | 146.69,80.77 145.03,80.77 144.53,80.26 U$71.22 144.53,79.12 149.35,74.3 152.35,74.3 U$74.1 152.45,74.3 153.19,74.3 v157.09,78.19 | U$71.18 147.14,80.31 146.69,80.77 | 122.87,57.63 121.22,57.63 120.84,57.25 U$59.22 120.84,55.34 124.22,51.97 128.21,51.97 U$62.1 | 122.87,57.63 124.53,57.63 124.78,57.38 124.78,56.64 U$59.16 | U$59.18 123.46,57.05 122.87,57.63 | U$67.16 142,56.77 142,57.5 141.74,57.76 140.09,57.76 | 140.09,57.76 138.57,57.76 138.06,57.25 U$67.22 138.06,55.85 141.82,52.09 145.55,52.09 U$70.1 | U$67.18 140.68,57.17 140.09,57.76 | U$30.1 U$30.2 161.77,62.38 162.18,61.98 162.81,61.98 163.07,62.23 U$30.4 U$30.5 163.73,66.04 | U$30.25 U$30.24 163.73,66.04 | 163.73,66.04 168.78,66.04 169.57,65.25 U$30.14 | U$29.25 U$29.24 U$29.5 163.73,51.59 163.32,51.18
  Top 0.25: 163.32,51.18 162.69,51.18 162.43,51.43 U$29.3 U$29.2 U$29.1 | 163.32,51.18 164.21,50.29 168.91,50.29 169.57,50.95 169.57,52.45 | 174.37,72.01 171.32,75.06 v165.86,75.06 | 174.37,68.83 174.37,62.48 | 185.42,40.82 v185.42,43.31 | v178.56,46.1 175.64,49.02 v175.51,49.02 | U$29.14 170.49,52.88 U$31.1 172.21,49.53 v173.48,48.26 173.48,60.2 | 173.48,60.2 174.37,61.09 | 129.64,51.62 U$62.1 | 116.01,46.85 116.04,46.83 131.05,46.83 132.08,47.86 132.08,54.06 | 116.01,46.85 98.6,46.85 | 76.7,47.75 75.97,47.01 67.13,47.01 66.75,46.63 v64.19,46.63 | v55.87,54.08 55.87,54.03 U$50.1 50.93,54.78 46.8,54.78 45.69,55.89 U$47.22 45.69,57.77 46.1,58.18 48.5,58.18 | v39.13,51.38 37.55,51.38 U$42.1 | U$70.1 146.62,51.2 | U$36.22 29.09,56.21 29.86,55.44 30.75,55.44 33.92,52.27 36.66,52.27 U$42.1 | U$47.18 48.31,57.99 48.5,58.18 | 48.5,58.18 49.3,58.18 49.6,57.88 U$47.16 | 76.7,47.75 77.58,46.88 98.57,46.88 98.6,46.85 | 98.6,46.85 95.68,46.85 91.1,51.43 | 132.08,54.06 v132.08,57.53 | U$62.1 132.08,54.06 | U$70.1 148.02,52.78 v148.1,52.78 | U$108.1 121.41,25.46 U$107.GND 121.35,25.4 121.41,25.4 v123.57,23.24 | v126.18,20.83 130.05,20.83 132.45,18.43 133.95,18.43 | v172.1,58.78 172.1,58.82 173.48,60.2
  Top 0.254: U$1.8 178.82,29.97 177.78,31.01 | U$1.47 177.78,31.01 | 178.18,47.88 U$20.1 177.67,48.18 U$17.1 v175.51,49.02 | v173.48,48.26 173.1,48.64 | 169.57,52.17 169.57,52.45 U$29.14 | U$32.2 174.37,60.96 174.37,61.09 174.37,62.48 174.37,62.99 | 174.37,62.99 176.53,65.15 U$33.2 | 174.37,62.99 172.21,65.15 U$34.1 169.85,63.42 U$30.14 | 174.37,72.01 174.37,68.83 | U$16.1 175.79,41.3 U$1.35 | 189.74,36.7 187.45,36.7 186.28,35.53 U$1.23 180.82,35.53 179.83,34.54 179.83,33.07 177.78,31.01 | U$9.1 161.21,23.8 v158.62,21.21 157.86,20.45 157.86,17.22 U$12.2 | v161.54,17.27 U$10.2 | U$105.GND 78.74,4.88 U$106.1
  Top 0.3: 179.35,8.91 U$7.1 180.91,7.35 180.91,7.05 | 172.01,14.94 U$3.1 172.01,14.3 173.1,13.21 176,13.21 177.34,14.55 | U$12.2 155.45,14.3 155.45,12.95 163.7,4.7 | 161.49,8.38 U$11.1 161.54,8.05 164.9,4.7 | U$18.5 190.83,20.95 U$18.6 188.72,8.91 184.78,8.91 | U$115.2 U$115.3 141.22,16.51 141.99,15.75 141.99,11.68 140.94,10.64 U$115.12 144.78,4.83 144.78,4.7 | 60.58,17.83 v74.79,17.83 93.6,17.83 | 60.58,17.83 50.12,17.83 v47.12,20.83 35.56,9.27 | U$95.GND 40.64,21.26 U$97.1 46.35,24.18 v46.35,23.49 | 93.6,17.83 v99.1,17.83 99.7,17.23 117.35,17.23 | U$99.GND 70.36,25.21 U$100.1 70.56,25.58 71.75,24.38 v71.75,22.86 | U$103.GND 96.01,25.46 U$104.1 96.09,25.58 v97.41,24.26 | 35.56,9.27 34.98,8.69 U$98.1 28.61,4.27 U$96.GND | 60.58,17.83 60.58,10.16 58.85,8.43 U$102.1 | U$106.1 83.11,9.14 84.96,9.14 84.96,9.19 93.6,17.83 | v137.37,72.49 136.91,72.96 U$66.1 | v122.05,72.77 121.16,73.66 U$58.1 | v99.19,72.39 97.61,73.97 97.61,74.17 | 80.82,75.06 81.51,74.37 81.51,74.32 | U$78.1 81.53,72.39 v82.42,71.5 | 35.56,9.27 35.56,5.09 32.82,2.35 17.16,2.35 6.6,12.91 J2.1 J2.2 | 121.41,25.4 U$108.1 | 116.84,21.01 U$107.GND | 170.1,4.7 178.56,4.7 179.64,5.78 | 170.1,4.7 164.9,4.7 | 164.9,4.7 163.7,4.7 | 161.96,4.7 156.26,4.7 | 156.26,4.7 153.54,4.7 | 153.54,4.7 144.78,4.7 | 144.78,4.7 v137.92,4.7 | 184.78,8.91 182.98,8.91 | 182.98,8.91 182.78,8.91 180.91,7.05 | 180.91,7.05 179.64,5.78 | v135.25,7.24 134.62,7.87 U$114.1 | 156.26,4.7 153.54,7.42 U$13.1 | U$8.1 170.1,4.7 | U$6.2 178.17,5.78 179.64,5.78 | U$6.3 177.19,11.07 177.93,11.81 180.09,11.81 182.98,8.91 | U$4.1 177.34,14.55 | 184.78,8.91 180.62,13.08 178.82,13.08 177.34,14.55
  Top 0.3: 163.7,4.7 161.96,4.7 | 161.96,4.7 152.02,14.64 152.02,15.88 147.3,20.59 v147.3,20.63 145.35,18.68 143.25,18.68 | U$116.1 149.35,8.89 153.54,4.7 | U$120.1 172.53,76.81 174.37,74.97 174.37,72.01 | U$110.1 109.31,9.2 117.35,17.23 | 143.25,18.68 134.2,18.68 133.95,18.43 132.75,17.23 117.35,17.23 | 143.25,18.68 143.2,18.63 143.2,16.68 144.03,15.85 U$115.21 | v147.32,24.2 U$112.1 145.3,25.58 142.4,22.68 142.4,21 U$111.GND
  Top 0.35: U$109.GND 104.34,4.57 U$110.1 | U$113.GND 133.04,7.87 U$114.1 | U$101.GND 53.75,4.27 U$102.1
  Route2 0.25: v160.15,79.63 158.5,79.63 158.5,79.58 v157.1,78.18 v157.09,78.19 155.92,78.19 | v185.42,43.31 183.26,45.47 179.2,45.47 v178.56,46.1 | v39.13,51.38 39.13,48.05 40.15,47.03 40.15,45.83 41.4,44.58 55.38,44.58 55.87,45.08 v55.87,54.08 | v60.58,71.12 48.39,71.12 48.32,71.18 | 48.32,71.18 46.99,72.52 v46.99,72.64 | 48.32,71.18 32.07,71.18 v30.23,73.02 | 55.87,53.59 v55.87,54.08 | v64.19,46.63 62.74,46.63 60.9,48.48 60.9,52.98 59.8,54.08 v55.87,54.08 | v148.92,57.51 152.93,57.51 154.2,58.78 v172.1,58.78
  Route2 0.3: 155.92,78.19 148.59,70.87 138.95,70.87 | 138.95,70.87 137.37,72.44 v137.37,72.49 | 138.95,70.87 124.97,70.87 | v122.05,72.77 123.06,72.77 124.97,70.87 | 124.97,70.87 103.5,70.87 101.98,72.39 v99.19,72.39 83.31,72.39 v82.42,71.5 60.96,71.5 v60.58,71.12
  Route15 0.25: v148.1,52.78 148.1,56.73 148.9,57.53
  Route15 0.3: v137.92,4.7 135.38,7.24 v135.25,7.24 | v132.08,57.53 148.9,57.53 v148.92,57.51
  Bottom 0.25: v183.51,22.23 190.04,22.23 U$18.5 191.77,23.95 191.77,33.15 | v190.25,36.7 191.77,35.18 191.77,33.15 | U$22.3 196.98,31.62 193.29,31.62 191.77,33.15 | v165.86,75.06 161.29,79.63 v160.15,79.63 | v123.57,23.24 125.98,20.83 v126.18,20.83
  Bottom 0.254: v175.51,49.02 174.75,48.26 v173.48,48.26 | v158.62,21.21 158.62,20.19 v161.54,17.27
  Bottom 0.3: v30.23,73.02 27.05,69.85 15.24,69.85 13.97,71.12 J1.19 | v74.79,17.83 71.75,20.86 v71.75,22.86 | v46.35,23.49 46.35,21.59 v47.12,20.83 | v99.1,17.83 97.41,19.52 v97.41,24.26 | v147.3,20.63 147.3,24.18 v147.32,24.2
  pour Top: 5.08,109.22 2.54,109.22 arc90 0,106.68 0,101.6 0,5.08 0,2.54 arc90 2.54,0 7.62,0 200.66,0 arc90 203.2,2.54 203.2,106.68 arc90 200.66,109.22 198.12,109.22
  pour Route15: 7.62,109.22 2.54,109.22 arc90 0,106.68 0,101.6 0,5.08 0,2.54 arc90 2.54,0 7.62,0 200.66,0 arc90 203.2,2.54 203.2,104.14 203.2,106.68 arc90 200.66,109.22 198.12,109.22
  pour Bottom: 5.08,109.22 2.54,109.22 arc90 0,106.68 0,2.54 arc90 2.54,0 7.62,0 200.66,0 arc90 203.2,2.54 203.2,106.68 arc90 200.66,109.22 198.12,109.22
I2C1_SCL  (via drill 0.2, 0.25)
  Top 0.254: U$129.1 170.94,32.13 172.34,33.53 | 172.34,33.53 U$1.42 | v170.81,33.53 172.34,33.53
  Top 0.3: U$115.22 v146.56,16.51 | v170.56,29.34 170.94,29.72 U$129.1 | U$29.26 162.43,57.4 162.05,57.02 159,57.02 158.7,57.33 | U$30.26 162.43,67.82 161.29,66.67 159.89,66.67 158.7,65.48 158.7,57.33 | v165.48,38.86 158.7,45.65 158.7,57.33
  Bottom 0.25: 24.9,38.86 17.22,38.86 15.8,40.28 15.8,46.48 15.3,46.98 14.9,46.98 14.48,47.4 14.48,49.08
  Bottom 0.254: 14.48,49.08 14.48,56.52 12.57,58.42 J1.14 | 23.79,38.86 24.9,38.86 v165.48,38.86 v170.81,33.53
  Bottom 0.3: v146.56,16.51 147.32,17.27 147.32,18.16 153.8,24.64 164.85,24.64 169.54,29.34 v170.56,29.34
I2C1_SDA  (via drill 0.2)
  Top 0.25: v157.61,56.64 157.97,57 157.97,66.15 159.13,67.31 160.81,67.31 161.77,68.28 | v22.99,46.1 32.18,46.1 33.1,45.18 154.53,45.18 155.45,46.1
  Top 0.3: 173.4,33.02 U$1.43 172.85,33.02 172.21,32.38 172.21,28.96 | U$128.1 172.21,28.96 | U$115.23 v147.83,17.14 | v172.21,28.07 172.21,28.96 | v151,20.19 149.22,20.19 v148.59,20.83 | v152.53,37.46 157.61,42.55 157.61,48.26 | 157.61,48.26 v157.61,56.64 | v160.02,60.96 161.29,60.96 161.77,60.48 U$29.27 | 161.77,68.28 U$30.27 | 155.45,46.1 157.61,48.26
  Route2 0.254: v22.99,46.1 16.89,52.2 16.89,55.24 J1.15
  Bottom 0.3: v172.21,28.07 172.21,26.29 171.83,25.91 167.64,25.91 165.61,23.88 154.69,23.88 v151,20.19 147.96,17.14 v147.83,17.14 | v148.59,20.83 148.59,23.11 151.38,25.91 151.38,36.32 v152.53,37.46 | v157.61,56.64 157.61,59.44 159.13,60.96 v160.02,60.96
N$7
  Top 0.25: U$126.1 181.59,20.34 181.59,23.88 U$124.1
N$9
  Top 0.25: U$127.1 181.61,14.48 181.61,19.56 180.85,20.32 180.85,21.97 179.07,23.75 175.9,23.75 174.73,24.92 U$125.1
OE#1
  Top 0.254: U$31.2 165.61,56.13 164.39,57.35 U$29.23
OE#2
  Top 0.254: U$34.2 172.21,70.61 171.32,71.5 164.72,71.5 164.34,71.12 164.34,69.22 U$30.23
OSC_IN  (via drill 0.25)
  Top 0.25: U$3.2 173.43,16.05 v172.47,17.02 | v168.91,18.16 167.96,19.11 167.96,20
  Top 0.254: U$1.5 v177.29,27.81
  Top 0.35: U$5.1 167.13,19.18 167.96,20 U$2.1
  Bottom 0.25: v172.47,17.02 170.05,17.02 v168.91,18.16
  Bottom 0.254: v177.29,27.81 177.29,27.36 177.3,27.35 177.3,23.12 174.12,19.94 174.12,18.29 172.85,17.02 v172.47,17.02
OSC_OUT  (via drill 0.25)
  Top 0.254: v177.93,27.15 177.8,27.28 U$1.6 | v177.16,21.97 U$2.2
  Top 0.35: U$5.2 173.99,20.32 U$2.2 178.76,18.72 U$4.2
  Bottom 0.254: v177.93,27.15 177.93,22.73 v177.16,21.97
PA0  (via drill 0.2)
  Top 0.254: U$1.10 179.81,30 v178.82,30.99
  Route2 0.25: 172.85,36.58 168.94,40.48 150.1,40.48 149.3,39.68 31.6,39.68 30.8,40.48 30.8,43.84 20.45,54.19
  Route2 0.254: v178.82,30.99 177.29,32.51 177.29,33.78 176.78,34.29 174.37,34.29 172.85,35.81 172.85,36.58 | 20.45,54.19 20.45,61.72 17.14,65.02 8.13,65.02 J2.16
PA1  (via drill 0.2)
  Top 0.254: U$1.11 180.31,30.25 v179.58,30.99 | J2.15 8.38,59.18 8.38,55.24 9.27,54.36 v21.97,54.36
  Route2 0.25: 173.48,36.91 169.31,41.08 149.5,41.08 148.6,40.18 32.1,40.18 31.3,40.98 31.3,44.23 21.97,53.56
  Route2 0.254: v179.58,30.99 177.93,32.64 177.93,34.04 177.04,34.92 174.5,34.92 173.48,35.94 173.48,36.91 | v21.97,54.36 21.97,53.56
PA2  (via drill 0.2, 0.3)
  Top 0.25: v18.8,46.32 15.75,49.38 9.29,49.38 9.02,49.66
  Top 0.254: U$1.12 180.8,30.53 v180.34,30.99 | 9.02,49.66 7.75,50.93 7.75,57.53 6.86,58.42 J2.14
  Route2 0.25: 173.89,37.28 173.88,37.28 169.49,41.67 149.29,41.67 148.2,40.58 138.9,40.58 138.1,41.38 136.6,41.38 135.9,40.68 113.3,40.68 112.4,41.58 111,41.58 110.1,40.68 88.6,40.68 87.8,41.48 85.7,41.48 85,40.78 62.8,40.78 62.2,41.38 60.8,41.38 60.2,40.78 32.7,40.78 32.2,41.28 v32.2,43.98
  Route2 0.254: v180.34,30.99 178.44,32.89 178.44,34.16 177.04,35.56 174.75,35.56 173.89,36.42 173.89,37.28
  Bottom 0.25: v32.2,43.98 19.4,43.98 19.15,44.23 19,44.38 18.8,44.58 v18.8,46.32
PA3  (via drill 0.2, 0.3)
  Top 0.254: U$1.13 181.56,30.53 v179.96,32.13
  Route2 0.25: 174.3,37.28 174.3,37.62 169.74,42.18 149,42.18 147.9,41.08 139.2,41.08 138.4,41.88 136.1,41.88 135.4,41.18 113.5,41.18 112.6,42.08 110.7,42.08 109.8,41.18 89,41.18 88.2,41.98 85.3,41.98 84.6,41.28 63.3,41.28 62.6,41.98 60.2,41.98 59.5,41.28 33.4,41.28 32.8,41.88 32.8,44.58 v32.2,45.18 | v19.5,46.68 14.4,51.78 10.7,51.78 J2.13
  Route2 0.254: v179.96,32.13 179.07,33.02 179.07,34.29 177.42,35.94 175.13,35.94 174.3,36.78 174.3,37.28
  Bottom 0.25: v32.2,45.18 31.5,44.48 20.6,44.48 20,45.08 19.7,45.38 19.5,45.58 v19.5,46.68
PA4  (via drill 0.2)
  Top 0.254: U$1.14 183.92,31.01 v184.15,31.24
  Route2 0.2: v17.77,41.51 7,41.51 5.33,43.18 5.33,48.64 6.22,49.53 7.11,49.53 7.75,50.16 7.75,52.2 J2.12 | v149.23,50.93 149.74,51.43 165.48,51.43
  Route2 0.254: v184.15,31.24 186.06,33.15 186.06,38.1 181.48,42.67 174.24,42.67 165.48,51.43
  Bottom 0.2: v149.23,50.93 139.84,41.53 17.79,41.53 v17.77,41.51
PA7  (via drill 0.2)
  Top 0.254: U$1.17 v180.85,32.51 | v21.21,45.34 20.07,44.2 8.13,44.2 J2.9
  Route2 0.25: 174.91,37.08 174.88,37.11 174.88,37.87 170.07,42.68 148.6,42.68 147.5,41.58 139.8,41.58 139,42.38 135.9,42.38 135.1,41.58 114.1,41.58 113.1,42.58 110.4,42.58 109.4,41.58 89.7,41.58 88.8,42.48 85,42.48 84.2,41.68 63.7,41.68 62.9,42.48 59.9,42.48 59.2,41.78 34.1,41.78 33.45,42.43 33.45,45.55 v32.25,46.75
  Route2 0.254: v180.85,32.51 179.58,33.78 179.58,34.54 177.55,36.58 175.39,36.58 174.91,37.05 174.91,37.08 174.91,37.85
  Bottom 0.254: v32.25,46.75 32.23,46.74 22.61,46.74 v21.21,45.34
PA8  (via drill 0.2)
  Top 0.2: U$1.29 178.82,36.7 179.45,36.07 v180.09,36.07
  Route15 0.2: v180.09,36.07 179.71,35.69 173.86,35.69 167,42.55 166.88,42.67 164.21,45.34 40.89,45.34 30.86,35.31 11.43,35.31 J1.5
PA11  (via drill 0.2)
  Top 0.2: U$1.32 177.29,40.64 v177.16,40.77 | v7.49,43.81 8.13,43.18 J1.8
  Route15 0.2: v177.16,40.77 177.04,40.89 172.47,40.89 163.45,49.91 108.9,49.91 108.33,50.48 106.57,50.48 106,49.91 37.08,49.91 36.72,49.55 36.51,49.55 36.24,49.28 33.91,49.28 33.02,50.16 28.19,50.16 26.29,48.26 14.35,48.26 13.59,47.5 9.91,47.5 7.49,45.09 v7.49,43.81
PA12  (via drill 0.2)
  Top 0.2: U$1.33 176.81,38.6 v176.66,38.75
  Route15 0.2: v176.66,38.75 171.26,38.75 164.29,45.72 24,45.72 23.11,44.83 13.97,44.83 13.08,45.72 J1.9
PA15  (via drill 0.2, 0.3)
  Top 0.254: U$1.38 172.75,35.53 v171.96,36.32
  Route2 0.25: v171.96,36.32 168.3,39.98 150.6,39.98 149.7,39.08 31.3,39.08 30.2,40.18 v30.2,43.28 | v20.8,43.28 20.8,42.68 20,41.88 18.6,41.88 17.7,42.78 17.7,46.78 16.9,47.58 11.86,47.58 J1.10
  Bottom 0.25: v30.2,43.28 v20.8,43.28
PB0  (via drill 0.2)
  Top 0.254: U$1.18 181.1,33.02 v180.59,33.53
  Route2 0.25: 175.51,38.1 170.43,43.18 148.3,43.18 147.08,41.96 140.32,41.96 139.2,43.08 36.1,43.08 35,44.18 35,45.73 v34.02,46.71
  Route2 0.254: v180.59,33.53 179.96,34.16 179.96,34.92 177.93,36.96 175.77,36.96 175.51,37.21 175.51,38.1 | v16.96,46.38 16.96,45.68 13.19,41.91 7.87,41.91 J2.8
  Bottom 0.254: v34.02,46.71 31.96,48.77 19.34,48.77 v16.96,46.38
PB1  (via drill 0.2)
  Top 0.254: U$1.19 v183.9,33.53 | v8.89,50.67 10.03,51.82 16.85,51.82 | v38.77,47.35 38.74,47.31 21.35,47.31
  Top 0.3: 16.85,51.82 21.35,47.31
  Route2 0.25: v38.77,47.35 39.5,46.62 39.5,44.58 40,44.08 171.31,44.08 171.36,44.04
  Route2 0.254: v183.9,33.53 184.78,34.42 184.78,36.96 180.85,40.89 178.56,40.89 177.8,41.66 173.74,41.66 171.36,44.04
  Bottom 0.254: v8.89,50.67 8.89,42.93 J2.7
PB3  (via drill 0.2, 0.3)
  Top 0.254: U$1.39 172.49,35.03 v171.2,36.32
  Route2 0.25: 168.27,39.25 168.14,39.38 151,39.38 150.2,38.58 30.6,38.58 29.6,39.58 v29.6,42.48 | v19.4,42.48 18.3,43.58 18.3,46.88 17,48.18 13.8,48.18 J1.11
  Route2 0.254: v171.2,36.32 168.27,39.25
  Bottom 0.25: v29.6,42.48 v19.4,42.48
PB4  (via drill 0.2)
  Top 0.254: U$1.40 172.36,34.52 171.32,35.56 v170.56,35.56 | v20.19,53.34 J1.12
  Route2 0.25: 28.07,45.47 29,44.53 29,39.08 30.1,37.98 150.8,37.98 151.5,38.68 156.9,38.68 157.63,37.95 168.17,37.95
  Route2 0.254: v170.56,35.56 168.17,37.95 | v20.19,53.34 28.07,45.47
PB5  (via drill 0.2)
  Top 0.254: U$1.41 172.21,34.04 171.45,34.8 v170.56,34.8
  Route2 0.25: 27.43,44.96 28.3,44.09 28.3,38.48 29.3,37.48 151.2,37.48 151.9,38.18 156.2,38.18 157.01,37.37 167.99,37.37
  Route2 0.254: v170.56,34.8 167.99,37.37 | 27.43,44.96 19.43,52.96 19.43,61.47 16.51,64.39 10.67,64.39 9.53,63.25 9.53,57.53 J1.13
PB8  (via drill 0.2)
  Top 0.254: U$1.45 175.54,32.03 v176.66,33.15
  Route2 0.25: 27.05,44.2 27.1,44.15 27.1,38.28 28.4,36.98 28.5,36.88 165.56,36.88 167.68,34.76
  Route2 0.254: v176.66,33.15 176.15,33.66 171.7,33.66 171.07,34.29 168.15,34.29 167.68,34.76 167.51,34.92 167.51,34.94 | 27.05,44.2 18.41,52.83 18.41,60.58 15.49,63.5 J1.16
PB9  (via drill 0.2)
  Top 0.254: U$1.46 175.79,31.52 v176.53,32.26 | v17.65,59.44 11.18,65.91 J1.17
  Route2 0.2: 26.54,43.69 26.6,43.63 26.6,37.88 28.13,36.35 164.97,36.35
  Route2 0.254: v176.53,32.26 175.64,33.15 173.74,33.15 173.35,32.77 168.02,32.77 167,33.78 167,34.31 164.97,36.35 | v17.65,59.44 17.65,52.58 26.54,43.69
PB10  (via drill 0.2, 0.3)
  Top 0.254: U$1.21 180.87,34.52 v180.72,34.67
  Route2 0.2: v165.48,33.78 150,33.78 | 150,33.78 148.84,33.78 | J2.6 8.22,36.48 12.65,36.48 14.35,34.78 16,34.78 16.2,34.78 18.7,34.78 19.7,33.78 150,33.78
  Bottom 0.2: v180.72,34.67 174.62,34.67 172.72,32.77 166.5,32.77 v165.48,33.78
PB11  (via drill 0.2)
  Top 0.254: U$1.22 183.87,35.03 v183.9,35.05 | J2.5 5.97,35.56 4.45,37.08 4.45,45.85 5.59,46.99 v16.78,46.99
  Route2 0.25: v36.32,50.04 36.9,49.46 36.9,44.08 37.4,43.58 171.05,43.58 171.22,43.41
  Route2 0.254: v183.9,35.05 183.9,36.96 180.47,40.39 178.53,40.39 177.64,41.27 173.35,41.27 171.22,43.41
  Bottom 0.254: v36.32,50.04 35.31,50.04 34.92,50.42 27.69,50.42 26.54,49.28 19.06,49.28 v16.78,46.99
PB12  (via drill 0.2)
  Top 0.2: U$1.25 180.8,39.29 v180.34,39.75
  Route15 0.2: v180.34,39.75 179.83,40.26 172.47,40.26 163.5,49.22 36.65,49.22 36.09,48.66 28.47,48.66 27.56,47.75 21.72,47.75 21.59,47.88 14.99,47.88 14.22,47.12 10.41,47.12 9.14,45.85 9.14,27.43 J1.1
PB13  (via drill 0.2)
  Top 0.2: U$1.26 180.31,38.76 v180.21,38.86
  Route15 0.2: v180.21,38.86 179.14,39.93 172.16,39.93 163.19,48.89 37.59,48.89 37.03,48.33 28.77,48.33 27.83,47.39 19.92,47.39 19.81,47.5 15.86,47.5 v14.65,46.28
  Bottom 0.2: v14.65,46.28 14.35,45.98 14.35,34.54 11.43,31.62 10.67,31.62 10.16,31.12 10.16,28.45 10.67,27.94 J1.2
PB14  (via drill 0.2)
  Top 0.2: U$1.27 179.81,38.66 v179.66,38.81
  Route15 0.2: v179.66,38.81 178.86,39.61 171.77,39.61 163.57,47.81 28.76,47.81 28.01,47.06 21.03,47.06 19.81,45.85 15.48,45.85 v15.26,46.07
  Bottom 0.2: v15.26,46.07 14.86,45.68 14.86,34.16 J1.3
PB15  (via drill 0.2)
  Top 0.2: U$1.28 179.31,38.53 178.94,38.9 v178.94,38.92
  Route15 0.2: v178.94,38.92 178.69,39.18 171.64,39.18 164.77,46.05 70.83,46.05 69.9,46.98 67.6,46.98 66.7,46.08 25.3,46.08 24.64,46.74 21.57,46.74 20.1,45.27 14.19,45.27 12.95,46.51 10.57,46.51 9.65,45.59 9.65,34.54 J1.4
PC13  (via drill 0.2)
  Top 0.25: U$127.2 183.13,14.99 | v183.83,15.68 184.4,16.26 184.4,25.78 183.51,26.67 176.4,26.67 175.79,27.28 U$1.2
  Top 0.254: 183.13,14.99 v183.83,15.68
  Top 0.35: v4.7,16.51 2.41,18.8 v2.41,18.92
  Route2 0.254: v183.83,15.68 183.83,8.06 177.78,2.01 15.75,2.01 4.7,13.06 v4.7,16.51
  Route2 0.35: v2.41,18.92 1.65,19.69 1.65,66.17 J2.19
PC14  (via drill 0.2, 0.25)
  Top 0.254: U$6.1 168.15,8.08 U$8.2 166.37,12.45 165.35,13.46 165.35,17.91 164.34,18.92 v164.34,21.34 | v176.3,27.45 U$1.3
  Route2 0.2: 166.3,34.08 164.5,35.88 27.8,35.88 26.1,37.58 26.1,41.59 24.3,43.39
  Route2 0.254: v164.34,21.34 166.3,23.3 166.3,34.08 | 24.51,43.18 24.3,43.39 16.13,51.56 v16.13,52.45
  Bottom 0.254: v164.34,21.34 167.51,24.51 173.86,24.51 176.3,26.95 v176.3,27.45 | v16.13,52.45 16.13,66.29 12.95,69.47 7.62,69.47 6.73,68.58 J2.18
PC15  (via drill 0.2, 0.25)
  Top 0.254: U$7.2 177.62,10.36 176.78,9.53 171.73,9.53 U$6.4 v168.5,11.07 165.99,13.59 165.99,18.16 165.1,19.05 165.1,21.34 v165.74,21.97 | v176.82,27.15 176.81,27.16 U$1.4
  Route2 0.25: 156.66,6.42 156.66,3.74 155.4,2.48 16.2,2.48 5.4,13.28 5.4,16.88 2.41,19.87 2.41,21.08
  Route2 0.254: v168.5,11.07 159.66,11.07 158.37,9.78 158.37,8.13 156.66,6.42 | J2.17 2.41,61.85 2.41,21.08
  Bottom 0.254: v165.74,21.97 167.9,24.13 174.02,24.13 176.82,26.93 v176.82,27.15
PGND1  (via drill 0.35, 0.75 pad 1.5)
  Top 0.5: v36.45,85.85 35.1,84.51 U$44.1 35.1,78.82 37.72,76.2 | U$45.2 39.09,83.44 v38.44,84.09 | U$38.2 v24.51,85.6 | v19.68,85.72 19.61,85.65 U$37.1 19.61,83.11 18.67,82.17 18.67,77.98 22.1,74.55 22.86,74.55 | U$35.3 21.84,72.52 | 21.84,72.52 U$35.4 | U$35.10 25.65,72.52 | 25.65,72.52 U$35.9 | U$43.3 37.72,72.52 | 37.72,72.52 U$43.4 | U$43.9 41.66,72.52 | 41.66,72.52 U$43.10 | U$51.3 52.7,72.52 | 52.7,72.52 U$51.4 | 56.52,72.52 U$51.10 56.64,72.26 | 56.52,72.52 U$51.9 | v51.18,85.72 50.34,84.89 U$52.1 50.34,81.97 49.91,81.53 49.91,77.72 52.83,74.8 53.34,74.8 | U$53.2 55.12,83.44 v54.1,84.45 | U$75.4 73.79,72.64 | 73.79,72.64 U$75.3 | U$75.9 77.72,72.64 | 77.72,72.64 U$75.10 | v72.77,85.72 72.19,85.14 U$76.1 72.19,82.6 70.87,81.28 70.87,78.11 74.3,74.68 | U$77.2 76.2,83.69 v75.31,84.58 | v88.01,85.6 87.43,85.01 U$84.1 87.43,82.73 87,82.3 87,77.47 89.85,74.61 | U$85.2 91.69,83.82 v90.93,84.58 | U$83.9 93.73,72.64 | 93.73,72.64 U$83.10 | U$83.4 89.79,72.64 | 89.79,72.64 U$83.3 | U$57.2 114.94,83.69 v114.17,84.45 | v110.74,85.72 110.74,84 U$56.1 110.8,77.8 114.05,74.55 114.3,74.55 | U$55.3 113.28,72.64 | 113.28,72.64 U$55.4 113.44,72.64 | U$55.10 117.22,72.64 | 117.22,72.64 U$55.9 | v126.95,85.7 126.67,85.42 U$64.1 126.67,77.16 129.16,74.68 | U$65.2 130.68,83.57 v130.05,84.2 | U$63.3 129.16,72.64 | 129.16,72.64 U$63.4 | U$63.10 132.97,72.64 | 132.97,72.64 U$63.9 | U$73.2 146.81,83.57 v145.92,84.45 | v142.88,85.6 142.8,85.52 U$72.1 142.42,83.31 142.42,76.53 144.65,74.3 144.78,74.3 | U$71.3 144.78,72.64 | 144.78,72.64 U$71.4 | U$71.9 148.84,72.64 | 148.84,72.64 U$71.10 | 22.86,74.55 21.84,73.53 21.84,72.52 | 22.86,74.55 24.13,74.55 25.65,73.02 25.65,72.52
  Top 0.5: 37.72,76.2 39.5,76.2 41.66,74.04 41.66,72.52 | 37.72,76.2 37.72,72.52 | 53.34,74.8 55.63,74.8 56.52,73.91 56.52,72.52 | 53.34,74.8 53.34,74.17 52.7,73.53 52.7,72.52 | 74.3,74.68 76.45,74.68 77.72,73.41 77.72,72.64 | 74.3,74.68 73.79,74.17 73.79,72.64 | 89.85,74.61 90.17,74.3 92.96,74.3 93.73,73.53 93.73,72.64 | 89.85,74.61 89.85,72.71 89.79,72.64 | 114.3,74.55 116.2,74.55 117.22,73.53 117.22,72.64 | 114.3,74.55 113.28,73.53 113.28,72.64 | 132.97,72.64 132.97,73.79 132.08,74.68 129.16,74.68 | 129.16,74.68 129.16,72.64 | 148.84,72.64 148.84,73.53 148.08,74.3 144.78,74.3 | 144.78,74.3 144.78,72.64
  Top 2: U$119.2 175.49,78.16 U$120.2
  Top 2.5: U$120.2 176.71,77.31 v181.3,72.72 184.37,69.65 U$117.1
  Route15 0.5: v24.51,85.6 27.18,88.27 | v19.68,85.72 22.23,88.27 27.18,88.27 | v90.93,84.58 90.93,85.91 96.25,91.23 | 27.18,88.27 29.65,90.74 29.65,91.23 | v36.45,85.85 38.44,87.84 | 38.44,87.84 41.83,91.23 42,91.23 | v38.44,84.09 38.44,87.84 | v51.18,85.72 54.1,88.65 | 56.35,91.23 56.35,90.89 54.1,88.65 | v54.1,84.45 54.1,88.65 | v72.77,85.72 78.28,91.23 78.5,91.23 | v75.31,84.58 75.31,86.69 79.85,91.23 81.1,91.23 | v88.01,85.6 93.05,90.64 93.05,91.23 | v110.74,85.72 110.74,87.47 114.5,91.23 | v114.17,84.45 114.17,87.35 118.05,91.23 | v126.95,85.7 132.48,91.23 133.05,91.23 | v130.05,84.2 130.05,86.23 135.05,91.23 136.05,91.23 | v142.88,85.6 142.88,87.41 146.7,91.23 | v145.92,84.45 145.92,86.95 150.2,91.23
  Route15 4.5: U$117.1 193.07,69.65 195.85,72.43 195.85,92.68 192.95,95.58 157.75,95.58 153.4,91.23 150.2,91.23 146.7,91.23 136.05,91.23 133.05,91.23 118.05,91.23 114.5,91.23 96.25,91.23 93.05,91.23 81.1,91.23 78.5,91.23 56.35,91.23 42,91.23 29.65,91.23
PGND2  (via drill 0.35, 0.75 pad 1.5)
  Top 0.5: U$41.2 31.9,62.44 v31.94,62.48 | v26.53,62.96 26.49,62.96 U$40.1 26.49,55.67 30.38,51.78 | U$36.9 33.28,49.86 | 33.28,49.86 U$36.10 | U$48.1 43.57,61.8 v43.55,61.83 | U$47.9 49.78,49.86 | 49.78,49.86 U$47.10 | U$47.4 45.72,49.86 | 45.72,49.86 U$47.3 | U$49.2 46.95,60.5 v46.57,60.88 | U$81.2 68.94,60.27 v68.18,61.03 | v65.39,61.67 65.31,61.59 U$80.1 64.37,59.2 64.37,55.82 68.18,52.02 | U$79.3 67.04,49.63 | 67.04,49.63 U$79.4 | U$79.9 70.85,49.63 | 70.85,49.63 U$79.10 | U$89.2 84.83,60.27 v84.57,60.52 | U$87.3 83.43,49.73 | 83.43,49.73 U$87.4 | U$87.9 87.24,49.73 | 87.24,49.73 U$87.10 | U$91.4 100.84,49.7 | 100.84,49.7 U$91.3 | U$91.9 104.65,49.7 | 104.65,49.7 U$91.10 | v97.79,62.02 97.79,61.44 U$92.1 98.99,59.02 97.67,57.7 97.67,54.53 100.84,51.35 | U$93.2 102.36,60.37 v101.73,61 | U$59.4 121.22,49.5 | 121.22,49.5 U$59.3 | U$59.9 125.03,49.5 | 125.03,49.5 U$59.10 | U$61.2 122.3,60.27 v121.92,60.65 | U$69.2 140.09,60.17 v139.58,60.68 | v135.77,61.82 135.77,60.98 U$68.1 135.77,59.1 135.77,54.2 138.44,51.53 | U$67.3 138.44,49.63 | 138.44,49.63 U$67.4 | U$67.9 142.25,49.63 | 142.25,49.63 U$67.10 | 30.38,51.78 32.25,51.78 33.28,50.74 33.28,49.86 | 30.38,51.78 29.48,50.87 29.48,49.86 | U$48.1 43.57,60.29 | 70.85,49.63 70.85,50.87 69.7,52.02 68.18,52.02 | 68.18,52.02 67.04,50.87 67.04,49.63 | 83.43,52.52 80.64,55.32 80.64,59.2 U$88.1 81.58,61.23 v81.94,61.59 | 87.24,49.73 87.24,51 85.72,52.52 83.43,52.52 | 83.43,52.52 83.43,49.73 | 100.84,51.35 103.38,51.35 104.65,50.08 104.65,49.7 | 100.84,51.35 100.84,49.7 | 121.22,51.28 118.78,53.72 118.78,60.16 U$60.1 119.07,61.01 v120.17,62.11 | 125.03,49.5 125.03,50.39 124.14,51.28 121.22,51.28
  Top 0.5: 121.22,51.28 121.22,49.5 | 138.44,51.53 141.49,51.53 142.25,50.77 142.25,49.63 | 138.44,51.53 138.44,49.63 | U$36.4 29.48,49.86 | 29.48,49.86 U$36.3 | 49.78,49.86 49.78,51.1 48.28,52.6 45.52,52.6 | 45.72,49.86 45.72,52.4 45.52,52.6 | U$48.1 43.57,54.55 45.52,52.6
  Top 2.5: U$118.1 v181.35,88.95 v181.34,88.95 180.14,88.95 178.22,87.03 178.17,87.03 172.07,80.92 U$119.1
  Route15 0.5: v43.55,61.83 43.55,63.42 49,68.88 50.95,68.88 52,67.83 46.57,62.4 v46.57,60.88 | v68.18,61.03 68.18,63.51 72.5,67.83 69.3,67.83 65.39,63.92 v65.39,61.67 | v81.94,61.59 81.94,64.87 84.9,67.83 | v84.57,60.52 84.57,63.15 90.5,69.08 92.75,69.08 94,67.83 | v97.79,62.02 103.6,67.83 105,67.83 | v101.73,61 108.56,67.83 109.25,67.83 | v120.17,62.11 125.89,67.83 126.9,67.83 | v121.92,60.65 129.1,67.83 130.2,67.83 | v135.77,61.82 141.72,67.76 143.15,67.76 | v139.58,60.68 146.67,67.76 146.8,67.76 | v31.94,62.48 37.29,67.83 41.15,67.83
  Route15 4.4: U$118.1 180.12,88.95 169.85,78.68 165.3,78.68
  Route15 4.5: 165.3,78.68 162.84,78.68 151.93,67.76 146.8,67.76 143.15,67.76 134.27,67.76 134.2,67.83 130.2,67.83 126.9,67.83 109.25,67.83 105,67.83 94,67.83 84.9,67.83 72.5,67.83 52,67.83 41.15,67.83 41.1,67.88
  Bottom 0.5: v26.53,62.96 27.05,63.48 30.93,63.48 v31.94,62.48 | v81.94,61.59 83.5,61.59 v84.57,60.52
PUMP0_H
  Top 0.25: U$35.1 U$35.2
  Top 0.3: U$35.1 19.43,73.25 19.43,75.95 17.14,78.23 17.14,91.75 28.74,103.35 U$121.1
PUMP0_L  (via drill 0.2)
  Top 0.25: U$35.5 U$35.6
  Top 0.3: U$35.5 22.78,71.81 22.23,71.25 19.81,71.25 18.92,72.14 18.92,75.69 16.64,77.98 16.64,92.52 v25.46,101.34
  Bottom 0.3: v25.46,101.34 25.49,101.37 U$121.2
PUMP1_H
  Top 0.25: U$35.11 U$35.12
  Top 0.3: U$35.11 26.67,71.37 25.4,70.1 19.43,70.1 17.91,71.63 17.91,75.18 15.62,77.47 15.62,93.28 23.43,101.09 24.19,101.09 27.88,104.77 30.54,104.77 31.41,103.91 U$121.3
PUMP1_L  (via drill 0.2)
  Top 0.25: U$35.7 U$35.8
  Top 0.3: U$35.7 24.08,71.7 23.11,70.74 19.68,70.74 18.5,71.93 18.5,75.36 16.13,77.72 16.13,92.9 v23.43,100.2
  Bottom 0.3: v23.43,100.2 30.24,100.2 U$121.4
PUMP2_H
  Top 0.25: U$36.1 U$36.2